# Altium project Miner_8TH.PrjPcb (part 1 of 2)
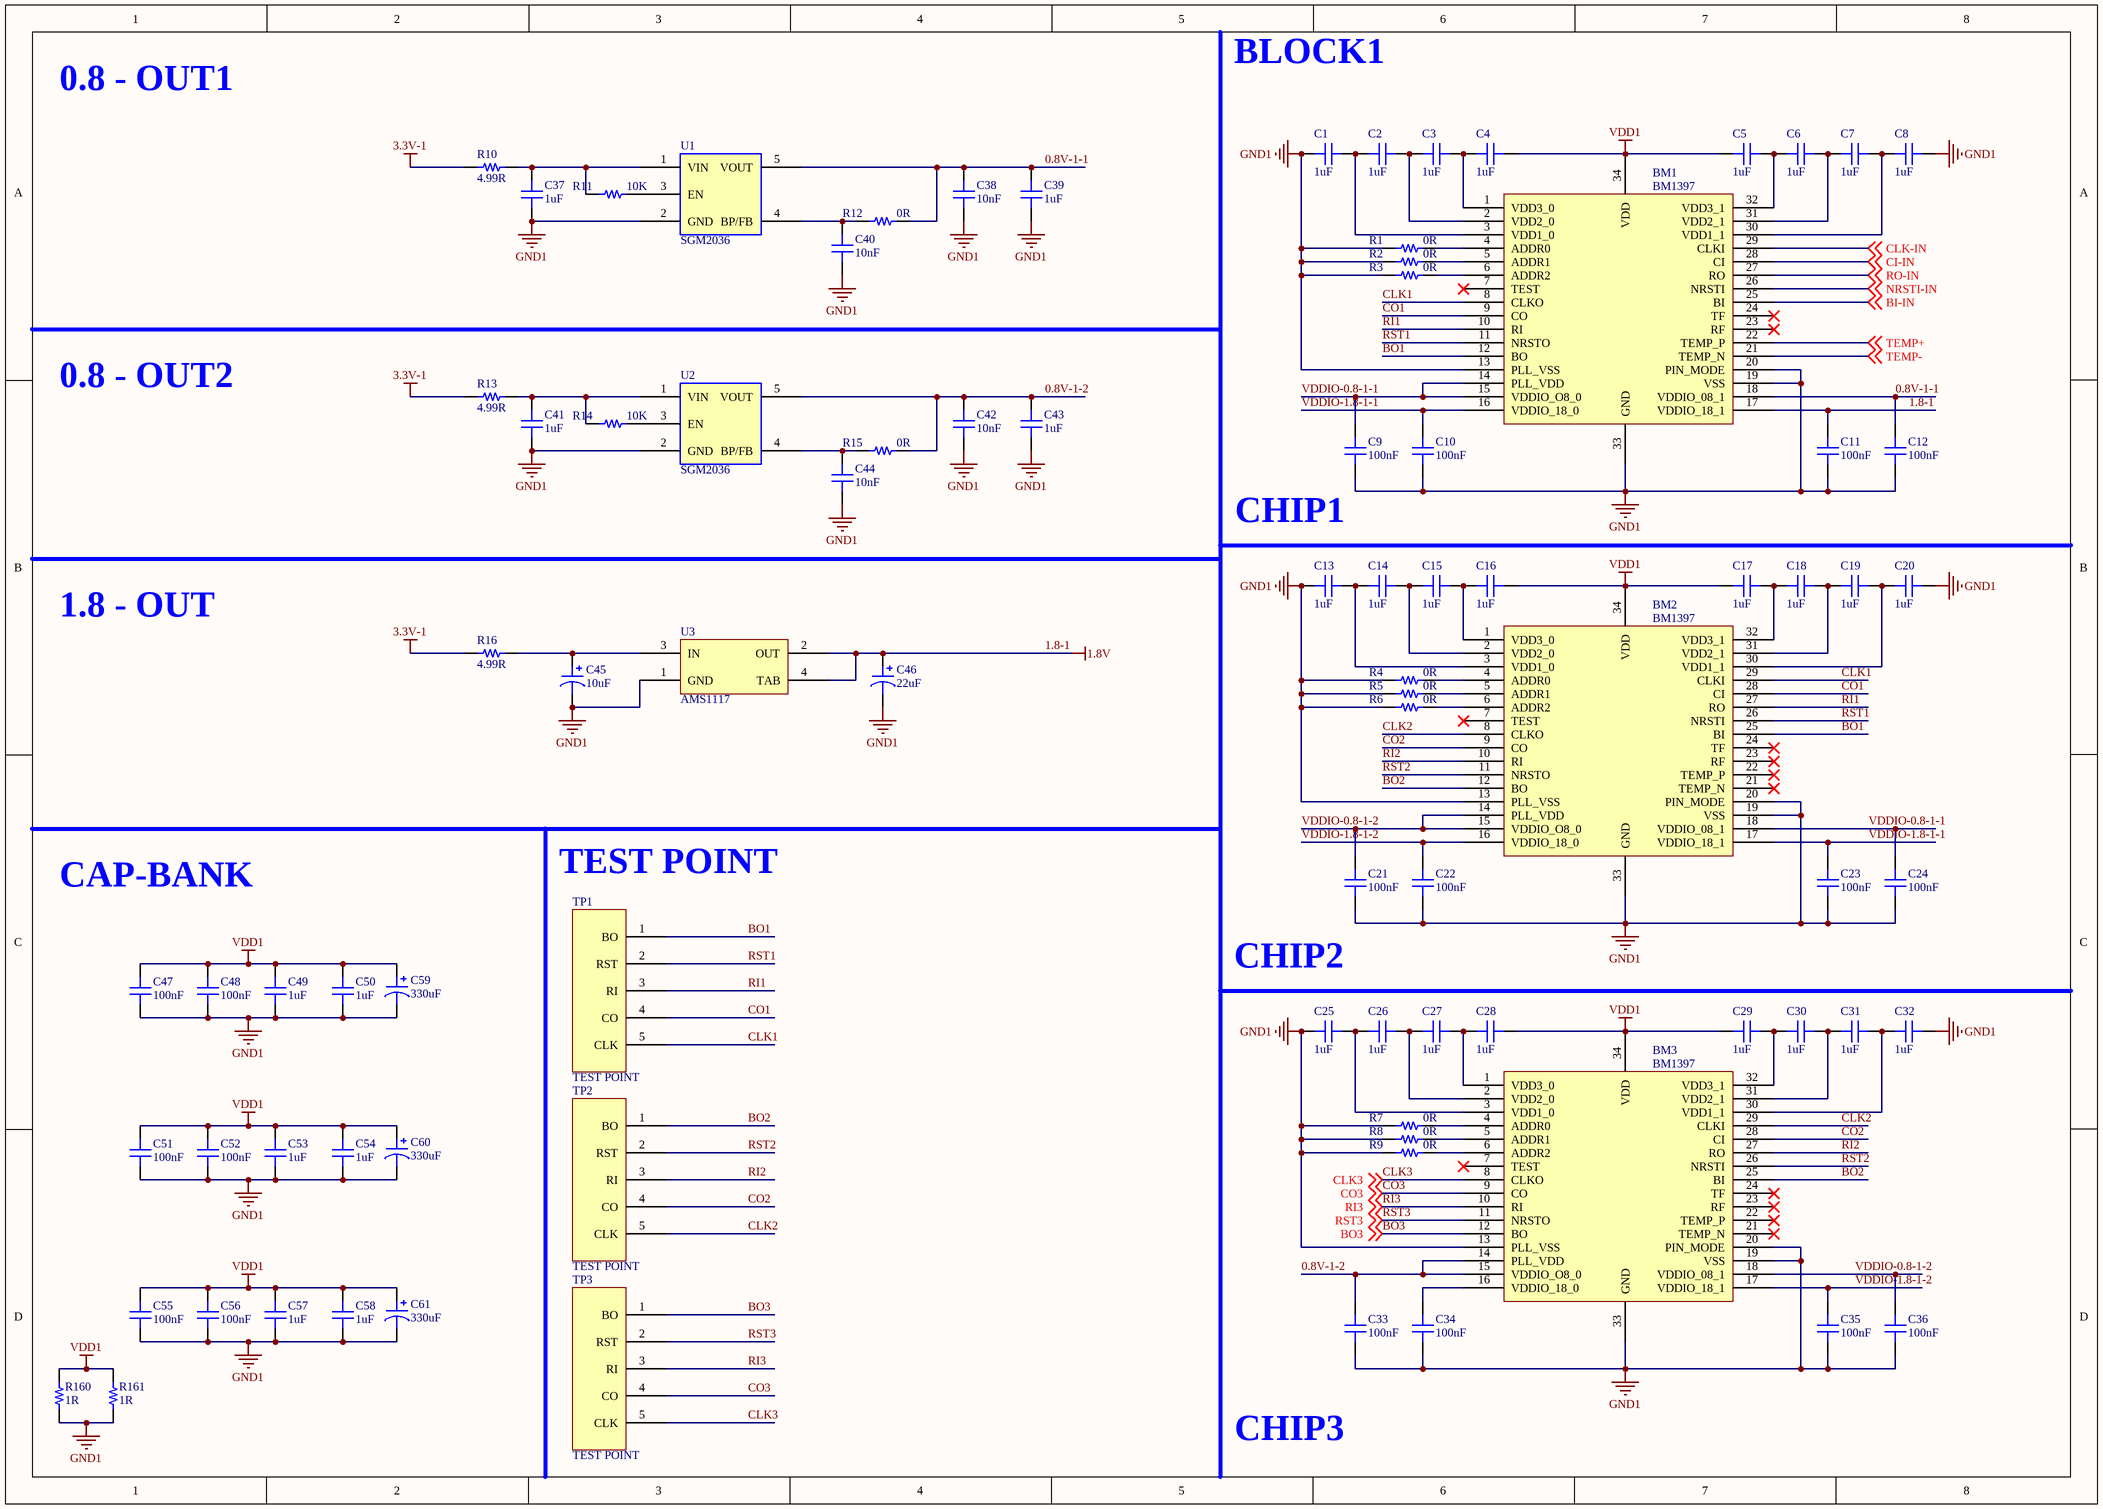
[diagram p0: BLOCK1.SchDoc]
12 sheets, 832 parts. Net scope: global (net labels, ports and power ports of the same name join across sheets).
Board file: Miner_8TH.PcbDoc
Sheets:
  BLOCK1.SchDoc
  BLOCK2.SchDoc
  BLOCK3.SchDoc
  BLOCK4.SchDoc
  BLOCK5.SchDoc
  BLOCK6.SchDoc
  BLOCK7.SchDoc
  BLOCK8.SchDoc
  Prepheral.SchDoc
  Power.SchDoc
  OUTPUT.SchDoc
  HEAT_SINK.SchDoc

## Sheet BLOCK1.SchDoc
size A3; SheetNumber: 1; SheetTotal: 12

### Parts
BM1  BM1397  [BM1387]
BM2  BM1397  [BM1387]
BM3  BM1397  [BM1387]
C1  1uF  [CAP-SMD-0603]
C2  1uF  [CAP-SMD-0603]
C3  1uF  [CAP-SMD-0603]
C4  1uF  [CAP-SMD-0603]
C5  1uF  [CAP-SMD-0603]
C6  1uF  [CAP-SMD-0603]
C7  1uF  [CAP-SMD-0603]
C8  1uF  [CAP-SMD-0603]
C9  100nF  [CAP_SMD_0805]
C10  100nF  [CAP_SMD_0805]
C11  100nF  [CAP_SMD_0805]
C12  100nF  [CAP_SMD_0805]
C13  1uF  [CAP-SMD-0603]
C14  1uF  [CAP-SMD-0603]
C15  1uF  [CAP-SMD-0603]
C16  1uF  [CAP-SMD-0603]
C17  1uF  [CAP-SMD-0603]
C18  1uF  [CAP-SMD-0603]
C19  1uF  [CAP-SMD-0603]
C20  1uF  [CAP-SMD-0603]
C21  100nF  [CAP_SMD_0805]
C22  100nF  [CAP_SMD_0805]
C23  100nF  [CAP_SMD_0805]
C24  100nF  [CAP_SMD_0805]
C25  1uF  [CAP-SMD-0603]
C26  1uF  [CAP-SMD-0603]
C27  1uF  [CAP-SMD-0603]
C28  1uF  [CAP-SMD-0603]
C29  1uF  [CAP-SMD-0603]
C30  1uF  [CAP-SMD-0603]
C31  1uF  [CAP-SMD-0603]
C32  1uF  [CAP-SMD-0603]
C33  100nF  [CAP_SMD_0805]
C34  100nF  [CAP_SMD_0805]
C35  100nF  [CAP_SMD_0805]
C36  100nF  [CAP_SMD_0805]
C37  1uF  [CAP_SMD_0805]
C38  10nF  [CAP_SMD_0805]
C39  1uF  [CAP_SMD_0805]
C40  10nF  [CAP_SMD_0805]
C41  1uF  [CAP_SMD_0805]
C42  10nF  [CAP_SMD_0805]
C43  1uF  [CAP_SMD_0805]
C44  10nF  [CAP_SMD_0805]
C45  10uF  [CAP-TAN-CASE-A]
C46  22uF  [CAP-TAN-CASE-A]
C47  100nF  [CAP_SMD_0805]
C48  100nF  [CAP_SMD_0805]
C49  1uF  [CAP_SMD_0805]
C50  1uF  [CAP_SMD_0805]
C51  100nF  [CAP_SMD_0805]
C52  100nF  [CAP_SMD_0805]
C53  1uF  [CAP_SMD_0805]
C54  1uF  [CAP_SMD_0805]
C55  100nF  [CAP_SMD_0805]
C56  100nF  [CAP_SMD_0805]
C57  1uF  [CAP_SMD_0805]
C58  1uF  [CAP_SMD_0805]
C59  330uF  [CAP-TAN-CASE-E]
C60  330uF  [CAP-TAN-CASE-E]
C61  330uF  [CAP-TAN-CASE-E]
R1  0R  [RES-SMD-0402]
R2  0R  [RES-SMD-0402]
R3  0R  [RES-SMD-0402]
R4  0R  [RES-SMD-0402]
R5  0R  [RES-SMD-0402]
R6  0R  [RES-SMD-0402]
R7  0R  [RES-SMD-0402]
R8  0R  [RES-SMD-0402]
R9  0R  [RES-SMD-0402]
R10  4.99R  [RES-SMD-1206]
R11  10K  [RES-SMD-0402]
R12  0R  [RES-SMD-0402]
R13  4.99R  [RES-SMD-1206]
R14  10K  [RES-SMD-0402]
R15  0R  [RES-SMD-0402]
R16  4.99R  [RES-SMD-1206]
R160  1R  [RES-SMD-1210]
R161  1R  [RES-SMD-1210]
TP1  TEST POINT  [TEST_POINT]
TP2  TEST POINT  [TEST_POINT]
TP3  TEST POINT  [TEST_POINT]
U1  SGM2036  [SOT23-5PIN]
U2  SGM2036  [SOT23-5PIN]
U3  AMS1117  [AMS1117]

### Nets
1.8-1: BM1.17(VDDIO_18_1) C11.2 C46.1 U3.2(OUT) U3.4(TAB)  [also labelled 1.8V]
3.3V-1: R10.1 R13.1 R16.1
GND1: BM1.13(PLL_VSS) BM1.19(VSS) BM1.20(PIN_MODE) BM1.33(GND) BM2.13(PLL_VSS) BM2.19(VSS) BM2.20(PIN_MODE) BM2.33(GND) BM3.13(PLL_VSS) BM3.19(VSS) BM3.20(PIN_MODE) BM3.33(GND) C1.1 C8.2 C9.1 C10.1 C11.1 C12.1 C13.1 C20.2 C21.1 C22.1 C23.1 C24.1 C25.1 C32.2 C33.1 C34.1 C35.1 C36.1 C37.1 C38.1 C39.1 C40.1 C41.1 C42.1 C43.1 C44.1 C45.2 C46.2 C47.1 C48.1 C49.1 C50.1 C51.1 C52.1 C53.1 C54.1 C55.1 C56.1 C57.1 C58.1 C59.2 C60.2 C61.2 R1.1 R2.1 R3.1 R4.1 R5.1 R6.1 R7.1 R8.1 R9.1 R160.1 R161.1 U1.2(GND) U2.2(GND) U3.1(GND)  [project net GND]
VDD1: BM1.34(VDD) BM2.34(VDD) BM3.34(VDD) C4.2 C5.1 C16.2 C17.1 C28.2 C29.1 C47.2 C48.2 C49.2 C50.2 C51.2 C52.2 C53.2 C54.2 C55.2 C56.2 C57.2 C58.2 C59.1 C60.1 C61.1 R160.2 R161.2  [project net GND2]
0.8V-1-1: BM1.18(VDDIO_08_1) C12.2 C38.2 C39.2 R12.2 U1.5(VOUT)
0.8V-1-2: BM3.14(PLL_VDD) BM3.15(VDDIO_O8_0) C33.2 C42.2 C43.2 R15.2 U2.5(VOUT)
BI-IN: BM1.25(BI) ; off-sheet BI-IN
BO1: BM1.12(BO) BM2.25(BI) TP1.1(BO)
BO2: BM2.12(BO) BM3.25(BI) TP2.1(BO)
BO3: BM3.12(BO) TP3.1(BO) ; off-sheet BO3
CI-IN: BM1.28(CI) ; off-sheet CI-IN
CLK1: BM1.8(CLKO) BM2.29(CLKI) TP1.5(CLK)
CLK2: BM2.8(CLKO) BM3.29(CLKI) TP2.5(CLK)
CLK3: BM3.8(CLKO) TP3.5(CLK) ; off-sheet CLK3
CLK-IN: BM1.29(CLKI) ; off-sheet CLK-IN
CO1: BM1.9(CO) BM2.28(CI) TP1.4(CO)
CO2: BM2.9(CO) BM3.28(CI) TP2.4(CO)
CO3: BM3.9(CO) TP3.4(CO) ; off-sheet CO3
NRSTI-IN: BM1.26(NRSTI) ; off-sheet NRSTI-IN
RI1: BM1.10(RI) BM2.27(RO) TP1.3(RI)
RI2: BM2.10(RI) BM3.27(RO) TP2.3(RI)
RI3: BM3.10(RI) TP3.3(RI) ; off-sheet RI3
RO-IN: BM1.27(RO) ; off-sheet RO-IN
RST1: BM1.11(NRSTO) BM2.26(NRSTI) TP1.2(RST)
RST2: BM2.11(NRSTO) BM3.26(NRSTI) TP2.2(RST)
RST3: BM3.11(NRSTO) TP3.2(RST) ; off-sheet RST3
TEMP+: BM1.22(TEMP_P) ; off-sheet TEMP+
TEMP-: BM1.21(TEMP_N) ; off-sheet TEMP-
VDDIO-0.8-1-1: BM1.14(PLL_VDD) BM1.15(VDDIO_O8_0) BM2.18(VDDIO_08_1) C9.2 C24.2
VDDIO-0.8-1-2: BM2.14(PLL_VDD) BM2.15(VDDIO_O8_0) BM3.18(VDDIO_08_1) C21.2 C36.2
VDDIO-1.8-1-1: BM1.16(VDDIO_18_0) BM2.17(VDDIO_18_1) C10.2 C23.2
VDDIO-1.8-1-2: BM2.16(VDDIO_18_0) BM3.17(VDDIO_18_1) C22.2 C35.2
NetBM1_1: BM1.1(VDD3_0) C3.2 C4.1
NetBM1_2: BM1.2(VDD2_0) C2.2 C3.1
NetBM1_3: BM1.3(VDD1_0) C1.2 C2.1
NetBM1_4: BM1.4(ADDR0) R1.2
NetBM1_5: BM1.5(ADDR1) R2.2
NetBM1_6: BM1.6(ADDR2) R3.2
NetBM1_30: BM1.30(VDD1_1) C7.2 C8.1
NetBM1_31: BM1.31(VDD2_1) C6.2 C7.1
NetBM1_32: BM1.32(VDD3_1) C5.2 C6.1
NetBM2_1: BM2.1(VDD3_0) C15.2 C16.1
NetBM2_2: BM2.2(VDD2_0) C14.2 C15.1
NetBM2_3: BM2.3(VDD1_0) C13.2 C14.1
NetBM2_4: BM2.4(ADDR0) R4.2
NetBM2_5: BM2.5(ADDR1) R5.2
NetBM2_6: BM2.6(ADDR2) R6.2
NetBM2_30: BM2.30(VDD1_1) C19.2 C20.1
NetBM2_31: BM2.31(VDD2_1) C18.2 C19.1
NetBM2_32: BM2.32(VDD3_1) C17.2 C18.1
NetBM3_1: BM3.1(VDD3_0) C27.2 C28.1
NetBM3_2: BM3.2(VDD2_0) C26.2 C27.1
NetBM3_3: BM3.3(VDD1_0) C25.2 C26.1
NetBM3_4: BM3.4(ADDR0) R7.2
NetBM3_5: BM3.5(ADDR1) R8.2
NetBM3_6: BM3.6(ADDR2) R9.2
NetBM3_16: BM3.16(VDDIO_18_0) C34.2
NetBM3_30: BM3.30(VDD1_1) C31.2 C32.1
NetBM3_31: BM3.31(VDD2_1) C30.2 C31.1
NetBM3_32: BM3.32(VDD3_1) C29.2 C30.1
NetC37_2: C37.2 R10.2 R11.1 U1.1(VIN)
NetC40_2: C40.2 R12.1 U1.4(BP/FB)
NetC41_2: C41.2 R13.2 R14.1 U2.1(VIN)
NetC44_2: C44.2 R15.1 U2.4(BP/FB)
NetC45_1: C45.1 R16.2 U3.3(IN)
NetR11_2: R11.2 U1.3(EN)
NetR14_2: R14.2 U2.3(EN)

Not connected (* = marked no-connect by the designer): BM1 7(TEST)* 23(RF)* 24(TF)*; BM2 7(TEST)* 21(TEMP_N)* 22(TEMP_P)* 23(RF)* 24(TF)*; BM3 7(TEST)* 21(TEMP_N)* 22(TEMP_P)* 23(RF)* 24(TF)*

### Notes on the sheet
- 0.8 - OUT1
- BLOCK1
- 0.8 - OUT2
- CHIP1
- 1.8 - OUT
- CAP-BANK
- TEST POINT
- CHIP2
- CHIP3

### Library data of the parts
BM1-BM3 = BM1397_0
C1-C44 C47-C58 = CAP
C45 C46 C59-C61 = POLARIZED CAP
R1-R16 R160 R161 = RES

## Sheet BLOCK2.SchDoc
size A3; SheetNumber: 2; SheetTotal: 12
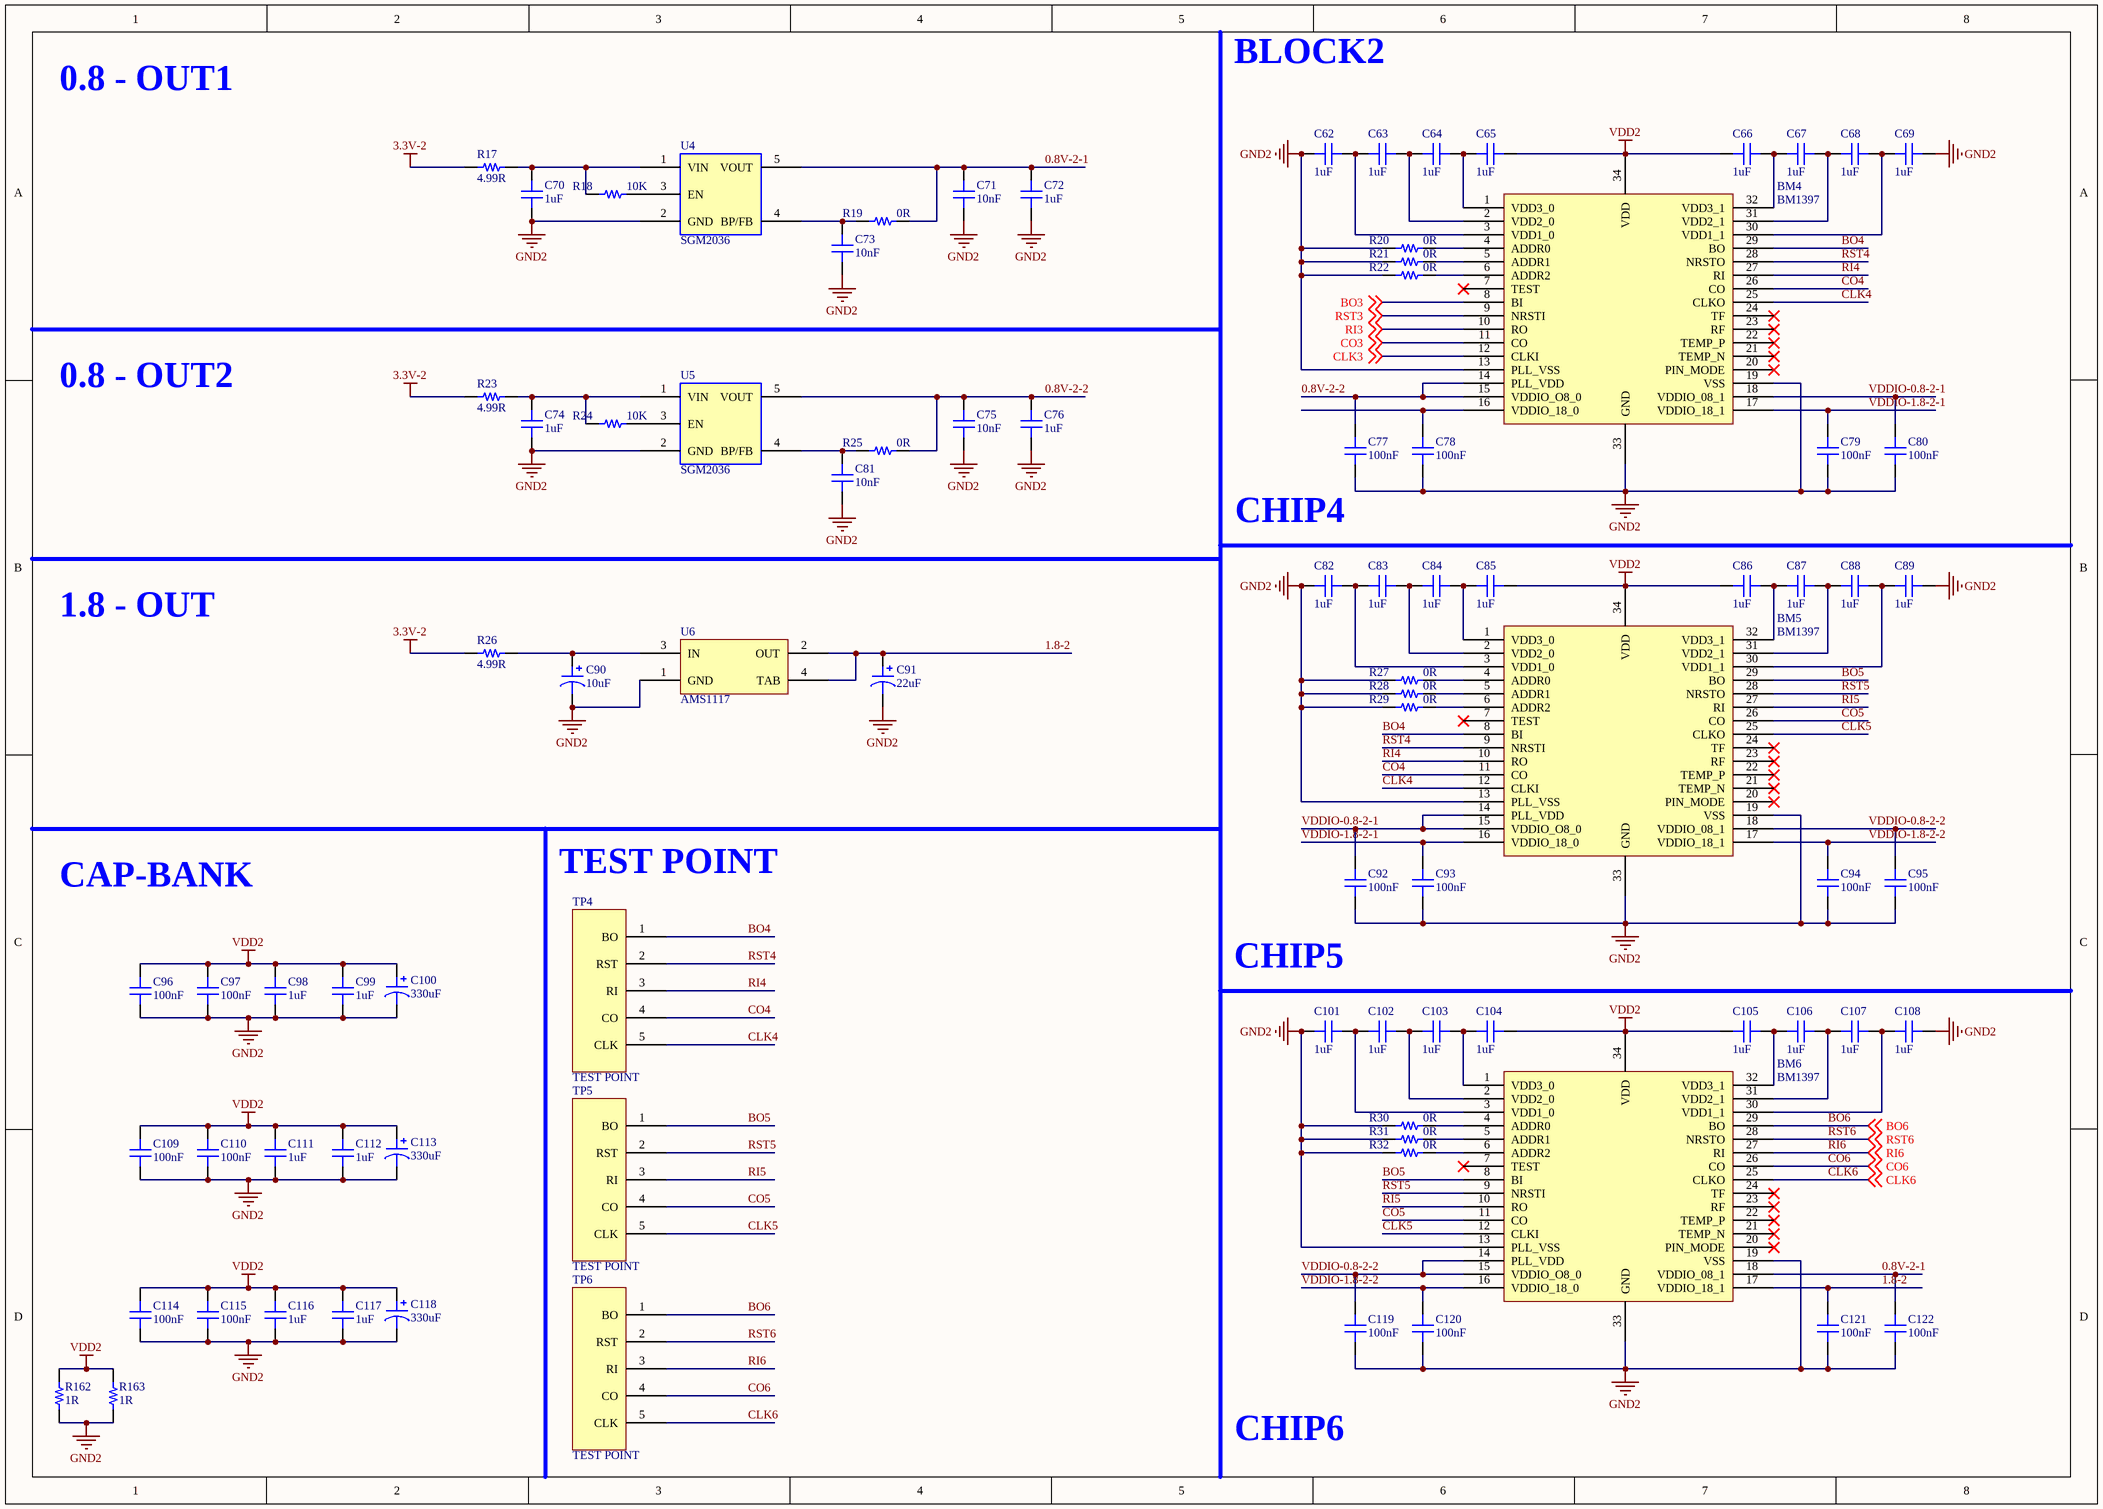
[diagram p1: BLOCK2.SchDoc]

### Parts
BM4  BM1397  [BM1387]
BM5  BM1397  [BM1387]
BM6  BM1397  [BM1387]
C62  1uF  [CAP-SMD-0603]
C63  1uF  [CAP-SMD-0603]
C64  1uF  [CAP-SMD-0603]
C65  1uF  [CAP-SMD-0603]
C66  1uF  [CAP-SMD-0603]
C67  1uF  [CAP-SMD-0603]
C68  1uF  [CAP-SMD-0603]
C69  1uF  [CAP-SMD-0603]
C70  1uF  [CAP_SMD_0805]
C71  10nF  [CAP_SMD_0805]
C72  1uF  [CAP_SMD_0805]
C73  10nF  [CAP_SMD_0805]
C74  1uF  [CAP_SMD_0805]
C75  10nF  [CAP_SMD_0805]
C76  1uF  [CAP_SMD_0805]
C77  100nF  [CAP_SMD_0805]
C78  100nF  [CAP_SMD_0805]
C79  100nF  [CAP_SMD_0805]
C80  100nF  [CAP_SMD_0805]
C81  10nF  [CAP_SMD_0805]
C82  1uF  [CAP-SMD-0603]
C83  1uF  [CAP-SMD-0603]
C84  1uF  [CAP-SMD-0603]
C85  1uF  [CAP-SMD-0603]
C86  1uF  [CAP-SMD-0603]
C87  1uF  [CAP-SMD-0603]
C88  1uF  [CAP-SMD-0603]
C89  1uF  [CAP-SMD-0603]
C90  10uF  [CAP-TAN-CASE-A]
C91  22uF  [CAP-TAN-CASE-A]
C92  100nF  [CAP_SMD_0805]
C93  100nF  [CAP_SMD_0805]
C94  100nF  [CAP_SMD_0805]
C95  100nF  [CAP_SMD_0805]
C96  100nF  [CAP_SMD_0805]
C97  100nF  [CAP_SMD_0805]
C98  1uF  [CAP_SMD_0805]
C99  1uF  [CAP_SMD_0805]
C100  330uF  [CAP-TAN-CASE-E]
C101  1uF  [CAP-SMD-0603]
C102  1uF  [CAP-SMD-0603]
C103  1uF  [CAP-SMD-0603]
C104  1uF  [CAP-SMD-0603]
C105  1uF  [CAP-SMD-0603]
C106  1uF  [CAP-SMD-0603]
C107  1uF  [CAP-SMD-0603]
C108  1uF  [CAP-SMD-0603]
C109  100nF  [CAP_SMD_0805]
C110  100nF  [CAP_SMD_0805]
C111  1uF  [CAP_SMD_0805]
C112  1uF  [CAP_SMD_0805]
C113  330uF  [CAP-TAN-CASE-E]
C114  100nF  [CAP_SMD_0805]
C115  100nF  [CAP_SMD_0805]
C116  1uF  [CAP_SMD_0805]
C117  1uF  [CAP_SMD_0805]
C118  330uF  [CAP-TAN-CASE-E]
C119  100nF  [CAP_SMD_0805]
C120  100nF  [CAP_SMD_0805]
C121  100nF  [CAP_SMD_0805]
C122  100nF  [CAP_SMD_0805]
R17  4.99R  [RES-SMD-1206]
R18  10K  [RES-SMD-0402]
R19  0R  [RES-SMD-0402]
R20  0R  [RES-SMD-0402]
R21  0R  [RES-SMD-0402]
R22  0R  [RES-SMD-0402]
R23  4.99R  [RES-SMD-1206]
R24  10K  [RES-SMD-0402]
R25  0R  [RES-SMD-0402]
R26  4.99R  [RES-SMD-1206]
R27  0R  [RES-SMD-0402]
R28  0R  [RES-SMD-0402]
R29  0R  [RES-SMD-0402]
R30  0R  [RES-SMD-0402]
R31  0R  [RES-SMD-0402]
R32  0R  [RES-SMD-0402]
R162  1R  [RES-SMD-1210]
R163  1R  [RES-SMD-1210]
TP4  TEST POINT  [TEST_POINT]
TP5  TEST POINT  [TEST_POINT]
TP6  TEST POINT  [TEST_POINT]
U4  SGM2036  [SOT23-5PIN]
U5  SGM2036  [SOT23-5PIN]
U6  AMS1117  [AMS1117]

### Nets
3.3V-2: R17.1 R23.1 R26.1
GND2: BM4.13(PLL_VSS) BM4.19(VSS) BM4.33(GND) BM5.13(PLL_VSS) BM5.19(VSS) BM5.33(GND) BM6.13(PLL_VSS) BM6.19(VSS) BM6.33(GND) C62.1 C69.2 C70.1 C71.1 C72.1 C73.1 C74.1 C75.1 C76.1 C77.1 C78.1 C79.1 C80.1 C81.1 C82.1 C89.2 C90.2 C91.2 C92.1 C93.1 C94.1 C95.1 C96.1 C97.1 C98.1 C99.1 C100.2 C101.1 C108.2 C109.1 C110.1 C111.1 C112.1 C113.2 C114.1 C115.1 C116.1 C117.1 C118.2 C119.1 C120.1 C121.1 C122.1 R20.1 R21.1 R22.1 R27.1 R28.1 R29.1 R30.1 R31.1 R32.1 R162.1 R163.1 U4.2(GND) U5.2(GND) U6.1(GND)
VDD2: BM4.34(VDD) BM5.34(VDD) BM6.34(VDD) C65.2 C66.1 C85.2 C86.1 C96.2 C97.2 C98.2 C99.2 C100.1 C104.2 C105.1 C109.2 C110.2 C111.2 C112.2 C113.1 C114.2 C115.2 C116.2 C117.2 C118.1 R162.2 R163.2  [project net 3.3V-1]
0.8V-2-1: BM6.18(VDDIO_08_1) C71.2 C72.2 C122.2 R19.2 U4.5(VOUT)
0.8V-2-2: BM4.14(PLL_VDD) BM4.15(VDDIO_O8_0) C75.2 C76.2 C77.2 R25.2 U5.5(VOUT)
1.8-2: BM6.17(VDDIO_18_1) C91.1 C121.2 U6.2(OUT) U6.4(TAB)
BO3: BM4.8(BI) ; off-sheet BO3
BO4: BM4.29(BO) BM5.8(BI) TP4.1(BO)
BO5: BM5.29(BO) BM6.8(BI) TP5.1(BO)
BO6: BM6.29(BO) TP6.1(BO) ; off-sheet BO6
CLK3: BM4.12(CLKI) ; off-sheet CLK3
CLK4: BM4.25(CLKO) BM5.12(CLKI) TP4.5(CLK)
CLK5: BM5.25(CLKO) BM6.12(CLKI) TP5.5(CLK)
CLK6: BM6.25(CLKO) TP6.5(CLK) ; off-sheet CLK6
CO3: BM4.11(CO) ; off-sheet CO3
CO4: BM4.26(CO) BM5.11(CO) TP4.4(CO)
CO5: BM5.26(CO) BM6.11(CO) TP5.4(CO)
CO6: BM6.26(CO) TP6.4(CO) ; off-sheet CO6
RI3: BM4.10(RO) ; off-sheet RI3
RI4: BM4.27(RI) BM5.10(RO) TP4.3(RI)
RI5: BM5.27(RI) BM6.10(RO) TP5.3(RI)
RI6: BM6.27(RI) TP6.3(RI) ; off-sheet RI6
RST3: BM4.9(NRSTI) ; off-sheet RST3
RST4: BM4.28(NRSTO) BM5.9(NRSTI) TP4.2(RST)
RST5: BM5.28(NRSTO) BM6.9(NRSTI) TP5.2(RST)
RST6: BM6.28(NRSTO) TP6.2(RST) ; off-sheet RST6
VDDIO-0.8-2-1: BM4.18(VDDIO_08_1) BM5.14(PLL_VDD) BM5.15(VDDIO_O8_0) C80.2 C92.2
VDDIO-0.8-2-2: BM5.18(VDDIO_08_1) BM6.14(PLL_VDD) BM6.15(VDDIO_O8_0) C95.2 C119.2
VDDIO-1.8-2-1: BM4.17(VDDIO_18_1) BM5.16(VDDIO_18_0) C79.2 C93.2
VDDIO-1.8-2-2: BM5.17(VDDIO_18_1) BM6.16(VDDIO_18_0) C94.2 C120.2
NetBM4_1: BM4.1(VDD3_0) C64.2 C65.1
NetBM4_2: BM4.2(VDD2_0) C63.2 C64.1
NetBM4_3: BM4.3(VDD1_0) C62.2 C63.1
NetBM4_4: BM4.4(ADDR0) R20.2
NetBM4_5: BM4.5(ADDR1) R21.2
NetBM4_6: BM4.6(ADDR2) R22.2
NetBM4_16: BM4.16(VDDIO_18_0) C78.2
NetBM4_30: BM4.30(VDD1_1) C68.2 C69.1
NetBM4_31: BM4.31(VDD2_1) C67.2 C68.1
NetBM4_32: BM4.32(VDD3_1) C66.2 C67.1
NetBM5_1: BM5.1(VDD3_0) C84.2 C85.1
NetBM5_2: BM5.2(VDD2_0) C83.2 C84.1
NetBM5_3: BM5.3(VDD1_0) C82.2 C83.1
NetBM5_4: BM5.4(ADDR0) R27.2
NetBM5_5: BM5.5(ADDR1) R28.2
NetBM5_6: BM5.6(ADDR2) R29.2
NetBM5_30: BM5.30(VDD1_1) C88.2 C89.1
NetBM5_31: BM5.31(VDD2_1) C87.2 C88.1
NetBM5_32: BM5.32(VDD3_1) C86.2 C87.1
NetBM6_1: BM6.1(VDD3_0) C103.2 C104.1
NetBM6_2: BM6.2(VDD2_0) C102.2 C103.1
NetBM6_3: BM6.3(VDD1_0) C101.2 C102.1
NetBM6_4: BM6.4(ADDR0) R30.2
NetBM6_5: BM6.5(ADDR1) R31.2
NetBM6_6: BM6.6(ADDR2) R32.2
NetBM6_30: BM6.30(VDD1_1) C107.2 C108.1
NetBM6_31: BM6.31(VDD2_1) C106.2 C107.1
NetBM6_32: BM6.32(VDD3_1) C105.2 C106.1
NetC70_2: C70.2 R17.2 R18.1 U4.1(VIN)
NetC73_2: C73.2 R19.1 U4.4(BP/FB)
NetC74_2: C74.2 R23.2 R24.1 U5.1(VIN)
NetC81_2: C81.2 R25.1 U5.4(BP/FB)
NetC90_1: C90.1 R26.2 U6.3(IN)
NetR18_2: R18.2 U4.3(EN)
NetR24_2: R24.2 U5.3(EN)

Not connected (* = marked no-connect by the designer): BM4 7(TEST)* 20(PIN_MODE)* 21(TEMP_N)* 22(TEMP_P)* 23(RF)* 24(TF)*; BM5 7(TEST)* 20(PIN_MODE)* 21(TEMP_N)* 22(TEMP_P)* 23(RF)* 24(TF)*; BM6 7(TEST)* 20(PIN_MODE)* 21(TEMP_N)* 22(TEMP_P)* 23(RF)* 24(TF)*

### Notes on the sheet
- 0.8 - OUT1
- BLOCK2
- 0.8 - OUT2
- CHIP4
- 1.8 - OUT
- CAP-BANK
- TEST POINT
- CHIP5
- CHIP6

### Library data of the parts
BM4-BM6 = BM1397_1
C62-C89 C92-C99 C101-C112 C114-C117 C119-C122 = CAP
C90 C91 C100 C113 C118 = POLARIZED CAP
R17-R32 R162 R163 = RES

## Sheet BLOCK3.SchDoc
size A3; SheetNumber: 3; SheetTotal: 12
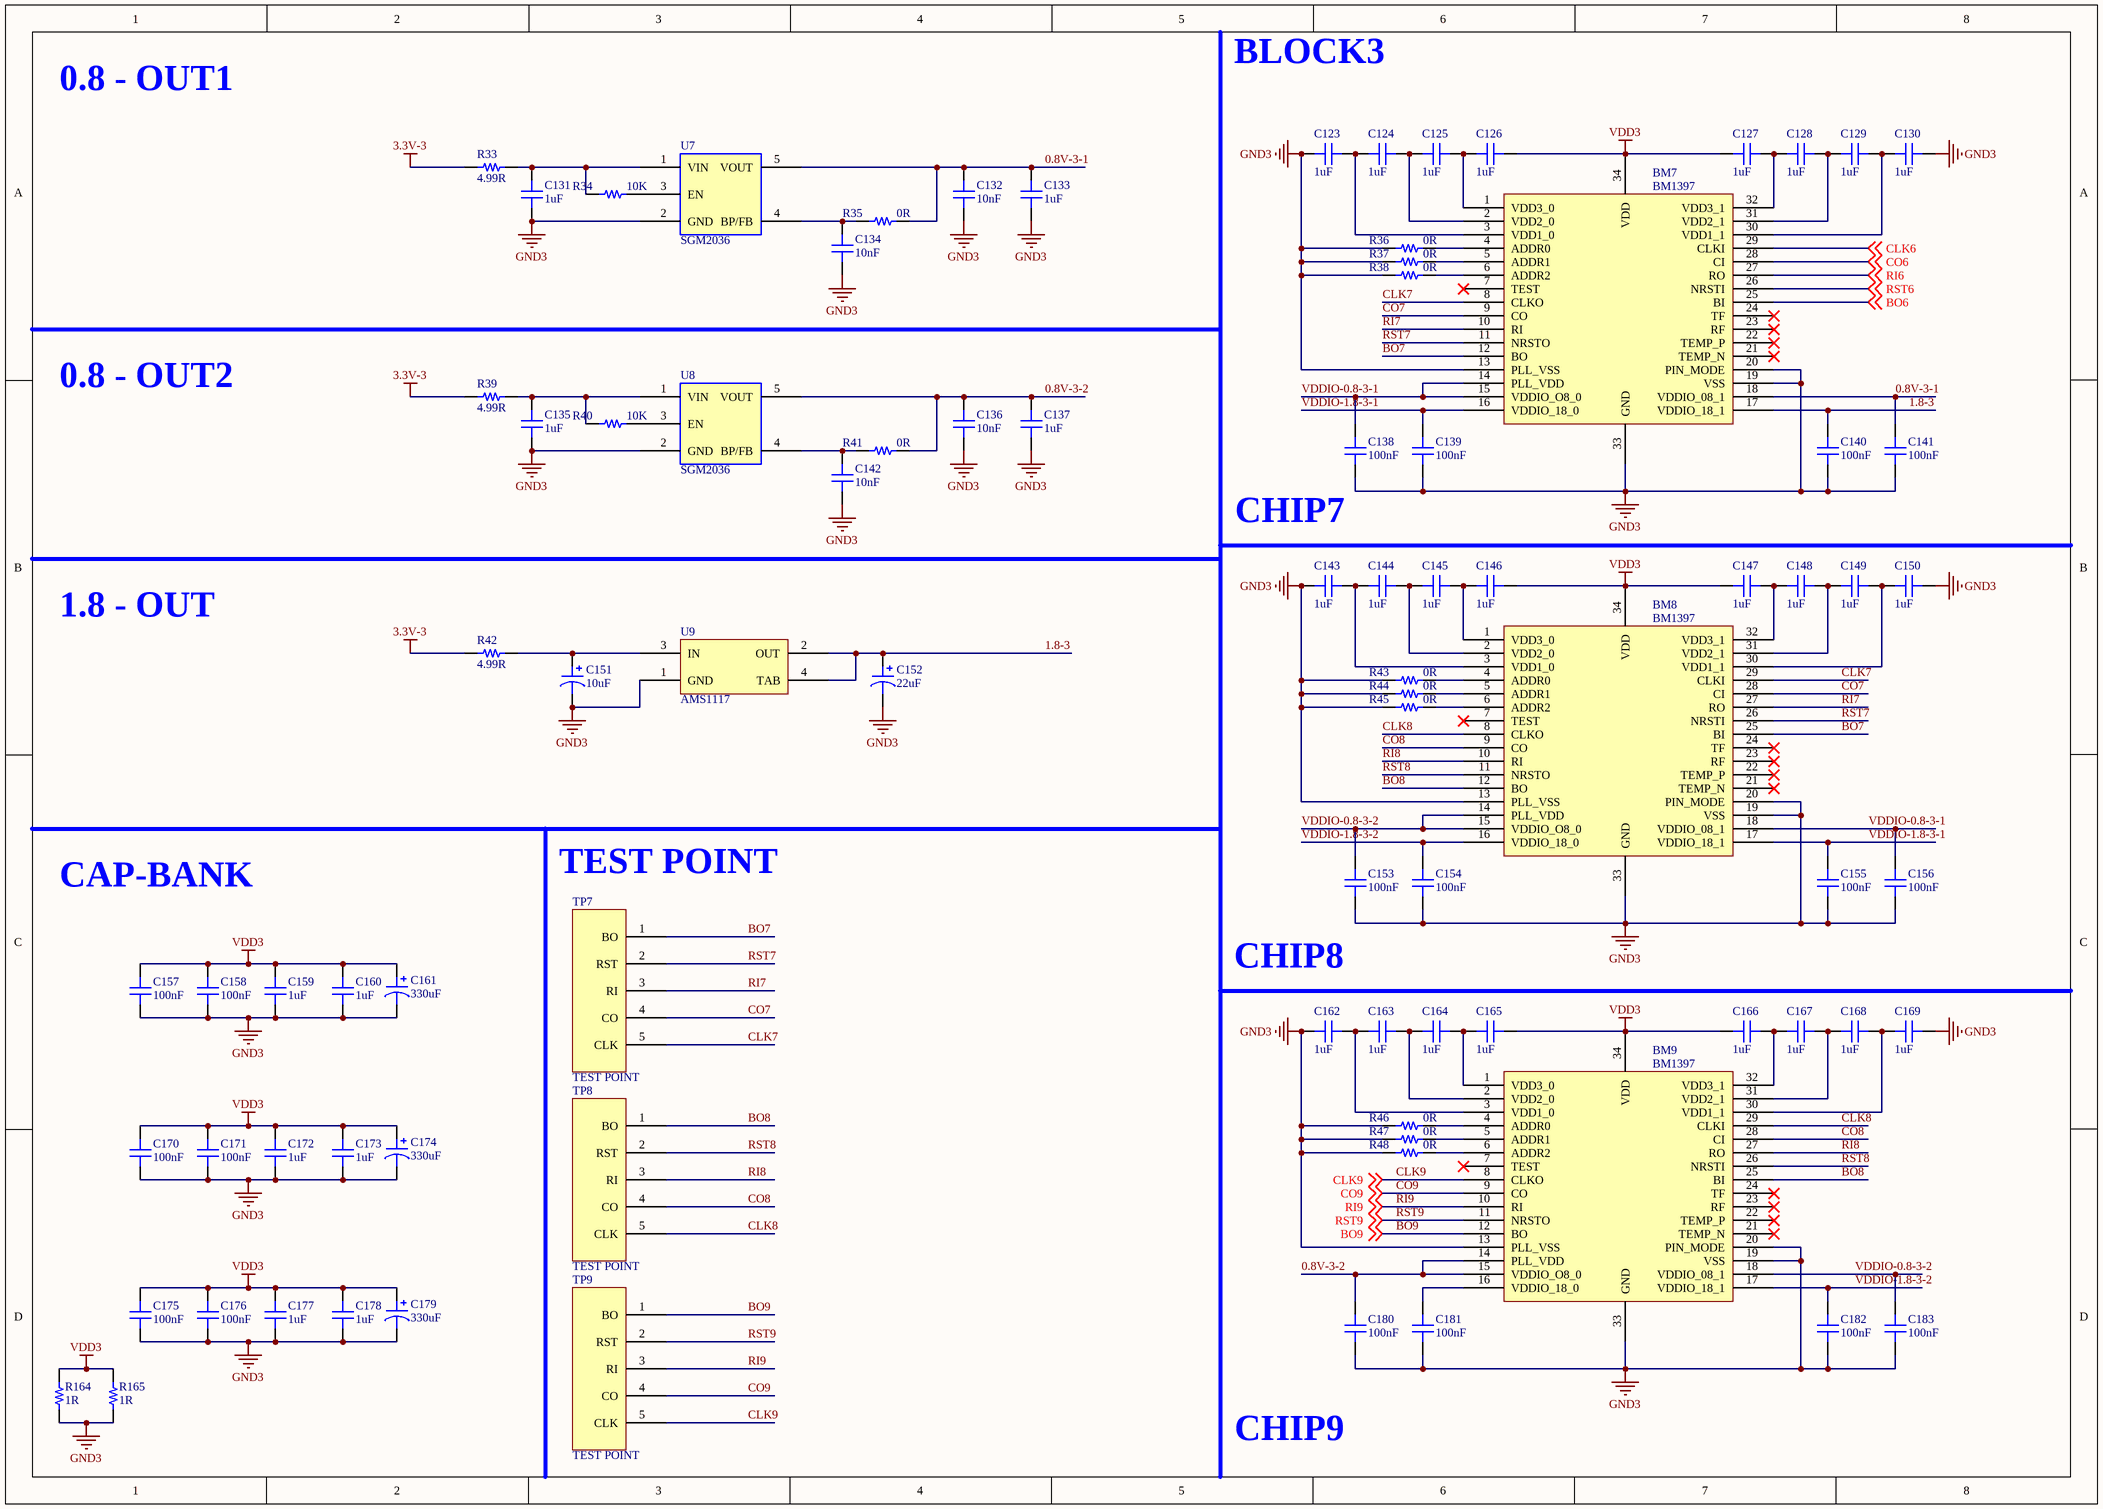
[diagram p2: BLOCK3.SchDoc]

### Parts
BM7  BM1397  [BM1387]
BM8  BM1397  [BM1387]
BM9  BM1397  [BM1387]
C123  1uF  [CAP-SMD-0603]
C124  1uF  [CAP-SMD-0603]
C125  1uF  [CAP-SMD-0603]
C126  1uF  [CAP-SMD-0603]
C127  1uF  [CAP-SMD-0603]
C128  1uF  [CAP-SMD-0603]
C129  1uF  [CAP-SMD-0603]
C130  1uF  [CAP-SMD-0603]
C131  1uF  [CAP_SMD_0805]
C132  10nF  [CAP_SMD_0805]
C133  1uF  [CAP_SMD_0805]
C134  10nF  [CAP_SMD_0805]
C135  1uF  [CAP_SMD_0805]
C136  10nF  [CAP_SMD_0805]
C137  1uF  [CAP_SMD_0805]
C138  100nF  [CAP_SMD_0805]
C139  100nF  [CAP_SMD_0805]
C140  100nF  [CAP_SMD_0805]
C141  100nF  [CAP_SMD_0805]
C142  10nF  [CAP_SMD_0805]
C143  1uF  [CAP-SMD-0603]
C144  1uF  [CAP-SMD-0603]
C145  1uF  [CAP-SMD-0603]
C146  1uF  [CAP-SMD-0603]
C147  1uF  [CAP-SMD-0603]
C148  1uF  [CAP-SMD-0603]
C149  1uF  [CAP-SMD-0603]
C150  1uF  [CAP-SMD-0603]
C151  10uF  [CAP-TAN-CASE-A]
C152  22uF  [CAP-TAN-CASE-A]
C153  100nF  [CAP_SMD_0805]
C154  100nF  [CAP_SMD_0805]
C155  100nF  [CAP_SMD_0805]
C156  100nF  [CAP_SMD_0805]
C157  100nF  [CAP_SMD_0805]
C158  100nF  [CAP_SMD_0805]
C159  1uF  [CAP_SMD_0805]
C160  1uF  [CAP_SMD_0805]
C161  330uF  [CAP-TAN-CASE-E]
C162  1uF  [CAP-SMD-0603]
C163  1uF  [CAP-SMD-0603]
C164  1uF  [CAP-SMD-0603]
C165  1uF  [CAP-SMD-0603]
C166  1uF  [CAP-SMD-0603]
C167  1uF  [CAP-SMD-0603]
C168  1uF  [CAP-SMD-0603]
C169  1uF  [CAP-SMD-0603]
C170  100nF  [CAP_SMD_0805]
C171  100nF  [CAP_SMD_0805]
C172  1uF  [CAP_SMD_0805]
C173  1uF  [CAP_SMD_0805]
C174  330uF  [CAP-TAN-CASE-E]
C175  100nF  [CAP_SMD_0805]
C176  100nF  [CAP_SMD_0805]
C177  1uF  [CAP_SMD_0805]
C178  1uF  [CAP_SMD_0805]
C179  330uF  [CAP-TAN-CASE-E]
C180  100nF  [CAP_SMD_0805]
C181  100nF  [CAP_SMD_0805]
C182  100nF  [CAP_SMD_0805]
C183  100nF  [CAP_SMD_0805]
R33  4.99R  [RES-SMD-1206]
R34  10K  [RES-SMD-0402]
R35  0R  [RES-SMD-0402]
R36  0R  [RES-SMD-0402]
R37  0R  [RES-SMD-0402]
R38  0R  [RES-SMD-0402]
R39  4.99R  [RES-SMD-1206]
R40  10K  [RES-SMD-0402]
R41  0R  [RES-SMD-0402]
R42  4.99R  [RES-SMD-1206]
R43  0R  [RES-SMD-0402]
R44  0R  [RES-SMD-0402]
R45  0R  [RES-SMD-0402]
R46  0R  [RES-SMD-0402]
R47  0R  [RES-SMD-0402]
R48  0R  [RES-SMD-0402]
R164  1R  [RES-SMD-1210]
R165  1R  [RES-SMD-1210]
TP7  TEST POINT  [TEST_POINT]
TP8  TEST POINT  [TEST_POINT]
TP9  TEST POINT  [TEST_POINT]
U7  SGM2036  [SOT23-5PIN]
U8  SGM2036  [SOT23-5PIN]
U9  AMS1117  [AMS1117]

### Nets
3.3V-3: R33.1 R39.1 R42.1
GND3: BM7.13(PLL_VSS) BM7.19(VSS) BM7.20(PIN_MODE) BM7.33(GND) BM8.13(PLL_VSS) BM8.19(VSS) BM8.20(PIN_MODE) BM8.33(GND) BM9.13(PLL_VSS) BM9.19(VSS) BM9.20(PIN_MODE) BM9.33(GND) C123.1 C130.2 C131.1 C132.1 C133.1 C134.1 C135.1 C136.1 C137.1 C138.1 C139.1 C140.1 C141.1 C142.1 C143.1 C150.2 C151.2 C152.2 C153.1 C154.1 C155.1 C156.1 C157.1 C158.1 C159.1 C160.1 C161.2 C162.1 C169.2 C170.1 C171.1 C172.1 C173.1 C174.2 C175.1 C176.1 C177.1 C178.1 C179.2 C180.1 C181.1 C182.1 C183.1 R36.1 R37.1 R38.1 R43.1 R44.1 R45.1 R46.1 R47.1 R48.1 R164.1 R165.1 U7.2(GND) U8.2(GND) U9.1(GND)  [project net 3.3V-1]
VDD3: BM7.34(VDD) BM8.34(VDD) BM9.34(VDD) C126.2 C127.1 C146.2 C147.1 C157.2 C158.2 C159.2 C160.2 C161.1 C165.2 C166.1 C170.2 C171.2 C172.2 C173.2 C174.1 C175.2 C176.2 C177.2 C178.2 C179.1 R164.2 R165.2  [project net 3.3V-2]
0.8V-3-1: BM7.18(VDDIO_08_1) C132.2 C133.2 C141.2 R35.2 U7.5(VOUT)
0.8V-3-2: BM9.14(PLL_VDD) BM9.15(VDDIO_O8_0) C136.2 C137.2 C180.2 R41.2 U8.5(VOUT)
1.8-3: BM7.17(VDDIO_18_1) C140.2 C152.1 U9.2(OUT) U9.4(TAB)
BO6: BM7.25(BI) ; off-sheet BO6
BO7: BM7.12(BO) BM8.25(BI) TP7.1(BO)
BO8: BM8.12(BO) BM9.25(BI) TP8.1(BO)
BO9: BM9.12(BO) TP9.1(BO) ; off-sheet BO9
CLK6: BM7.29(CLKI) ; off-sheet CLK6
CLK7: BM7.8(CLKO) BM8.29(CLKI) TP7.5(CLK)
CLK8: BM8.8(CLKO) BM9.29(CLKI) TP8.5(CLK)
CLK9: BM9.8(CLKO) TP9.5(CLK) ; off-sheet CLK9
CO6: BM7.28(CI) ; off-sheet CO6
CO7: BM7.9(CO) BM8.28(CI) TP7.4(CO)
CO8: BM8.9(CO) BM9.28(CI) TP8.4(CO)
CO9: BM9.9(CO) TP9.4(CO) ; off-sheet CO9
RI6: BM7.27(RO) ; off-sheet RI6
RI7: BM7.10(RI) BM8.27(RO) TP7.3(RI)
RI8: BM8.10(RI) BM9.27(RO) TP8.3(RI)
RI9: BM9.10(RI) TP9.3(RI) ; off-sheet RI9
RST6: BM7.26(NRSTI) ; off-sheet RST6
RST7: BM7.11(NRSTO) BM8.26(NRSTI) TP7.2(RST)
RST8: BM8.11(NRSTO) BM9.26(NRSTI) TP8.2(RST)
RST9: BM9.11(NRSTO) TP9.2(RST) ; off-sheet RST9
VDDIO-0.8-3-1: BM7.14(PLL_VDD) BM7.15(VDDIO_O8_0) BM8.18(VDDIO_08_1) C138.2 C156.2
VDDIO-0.8-3-2: BM8.14(PLL_VDD) BM8.15(VDDIO_O8_0) BM9.18(VDDIO_08_1) C153.2 C183.2
VDDIO-1.8-3-1: BM7.16(VDDIO_18_0) BM8.17(VDDIO_18_1) C139.2 C155.2
VDDIO-1.8-3-2: BM8.16(VDDIO_18_0) BM9.17(VDDIO_18_1) C154.2 C182.2
NetBM7_1: BM7.1(VDD3_0) C125.2 C126.1
NetBM7_2: BM7.2(VDD2_0) C124.2 C125.1
NetBM7_3: BM7.3(VDD1_0) C123.2 C124.1
NetBM7_4: BM7.4(ADDR0) R36.2
NetBM7_5: BM7.5(ADDR1) R37.2
NetBM7_6: BM7.6(ADDR2) R38.2
NetBM7_30: BM7.30(VDD1_1) C129.2 C130.1
NetBM7_31: BM7.31(VDD2_1) C128.2 C129.1
NetBM7_32: BM7.32(VDD3_1) C127.2 C128.1
NetBM8_1: BM8.1(VDD3_0) C145.2 C146.1
NetBM8_2: BM8.2(VDD2_0) C144.2 C145.1
NetBM8_3: BM8.3(VDD1_0) C143.2 C144.1
NetBM8_4: BM8.4(ADDR0) R43.2
NetBM8_5: BM8.5(ADDR1) R44.2
NetBM8_6: BM8.6(ADDR2) R45.2
NetBM8_30: BM8.30(VDD1_1) C149.2 C150.1
NetBM8_31: BM8.31(VDD2_1) C148.2 C149.1
NetBM8_32: BM8.32(VDD3_1) C147.2 C148.1
NetBM9_1: BM9.1(VDD3_0) C164.2 C165.1
NetBM9_2: BM9.2(VDD2_0) C163.2 C164.1
NetBM9_3: BM9.3(VDD1_0) C162.2 C163.1
NetBM9_4: BM9.4(ADDR0) R46.2
NetBM9_5: BM9.5(ADDR1) R47.2
NetBM9_6: BM9.6(ADDR2) R48.2
NetBM9_16: BM9.16(VDDIO_18_0) C181.2
NetBM9_30: BM9.30(VDD1_1) C168.2 C169.1
NetBM9_31: BM9.31(VDD2_1) C167.2 C168.1
NetBM9_32: BM9.32(VDD3_1) C166.2 C167.1
NetC131_2: C131.2 R33.2 R34.1 U7.1(VIN)
NetC134_2: C134.2 R35.1 U7.4(BP/FB)
NetC135_2: C135.2 R39.2 R40.1 U8.1(VIN)
NetC142_2: C142.2 R41.1 U8.4(BP/FB)
NetC151_1: C151.1 R42.2 U9.3(IN)
NetR34_2: R34.2 U7.3(EN)
NetR40_2: R40.2 U8.3(EN)

Not connected (* = marked no-connect by the designer): BM7 7(TEST)* 21(TEMP_N)* 22(TEMP_P)* 23(RF)* 24(TF)*; BM8 7(TEST)* 21(TEMP_N)* 22(TEMP_P)* 23(RF)* 24(TF)*; BM9 7(TEST)* 21(TEMP_N)* 22(TEMP_P)* 23(RF)* 24(TF)*

### Notes on the sheet
- 0.8 - OUT1
- BLOCK3
- 0.8 - OUT2
- CHIP7
- 1.8 - OUT
- CAP-BANK
- TEST POINT
- CHIP8
- CHIP9

### Library data of the parts
BM7-BM9 = BM1397_0
C123-C150 C153-C160 C162-C173 C175-C178 C180-C183 = CAP
C151 C152 C161 C174 C179 = POLARIZED CAP
R33-R48 R164 R165 = RES

## Sheet BLOCK4.SchDoc
size A3; SheetNumber: 4; SheetTotal: 12
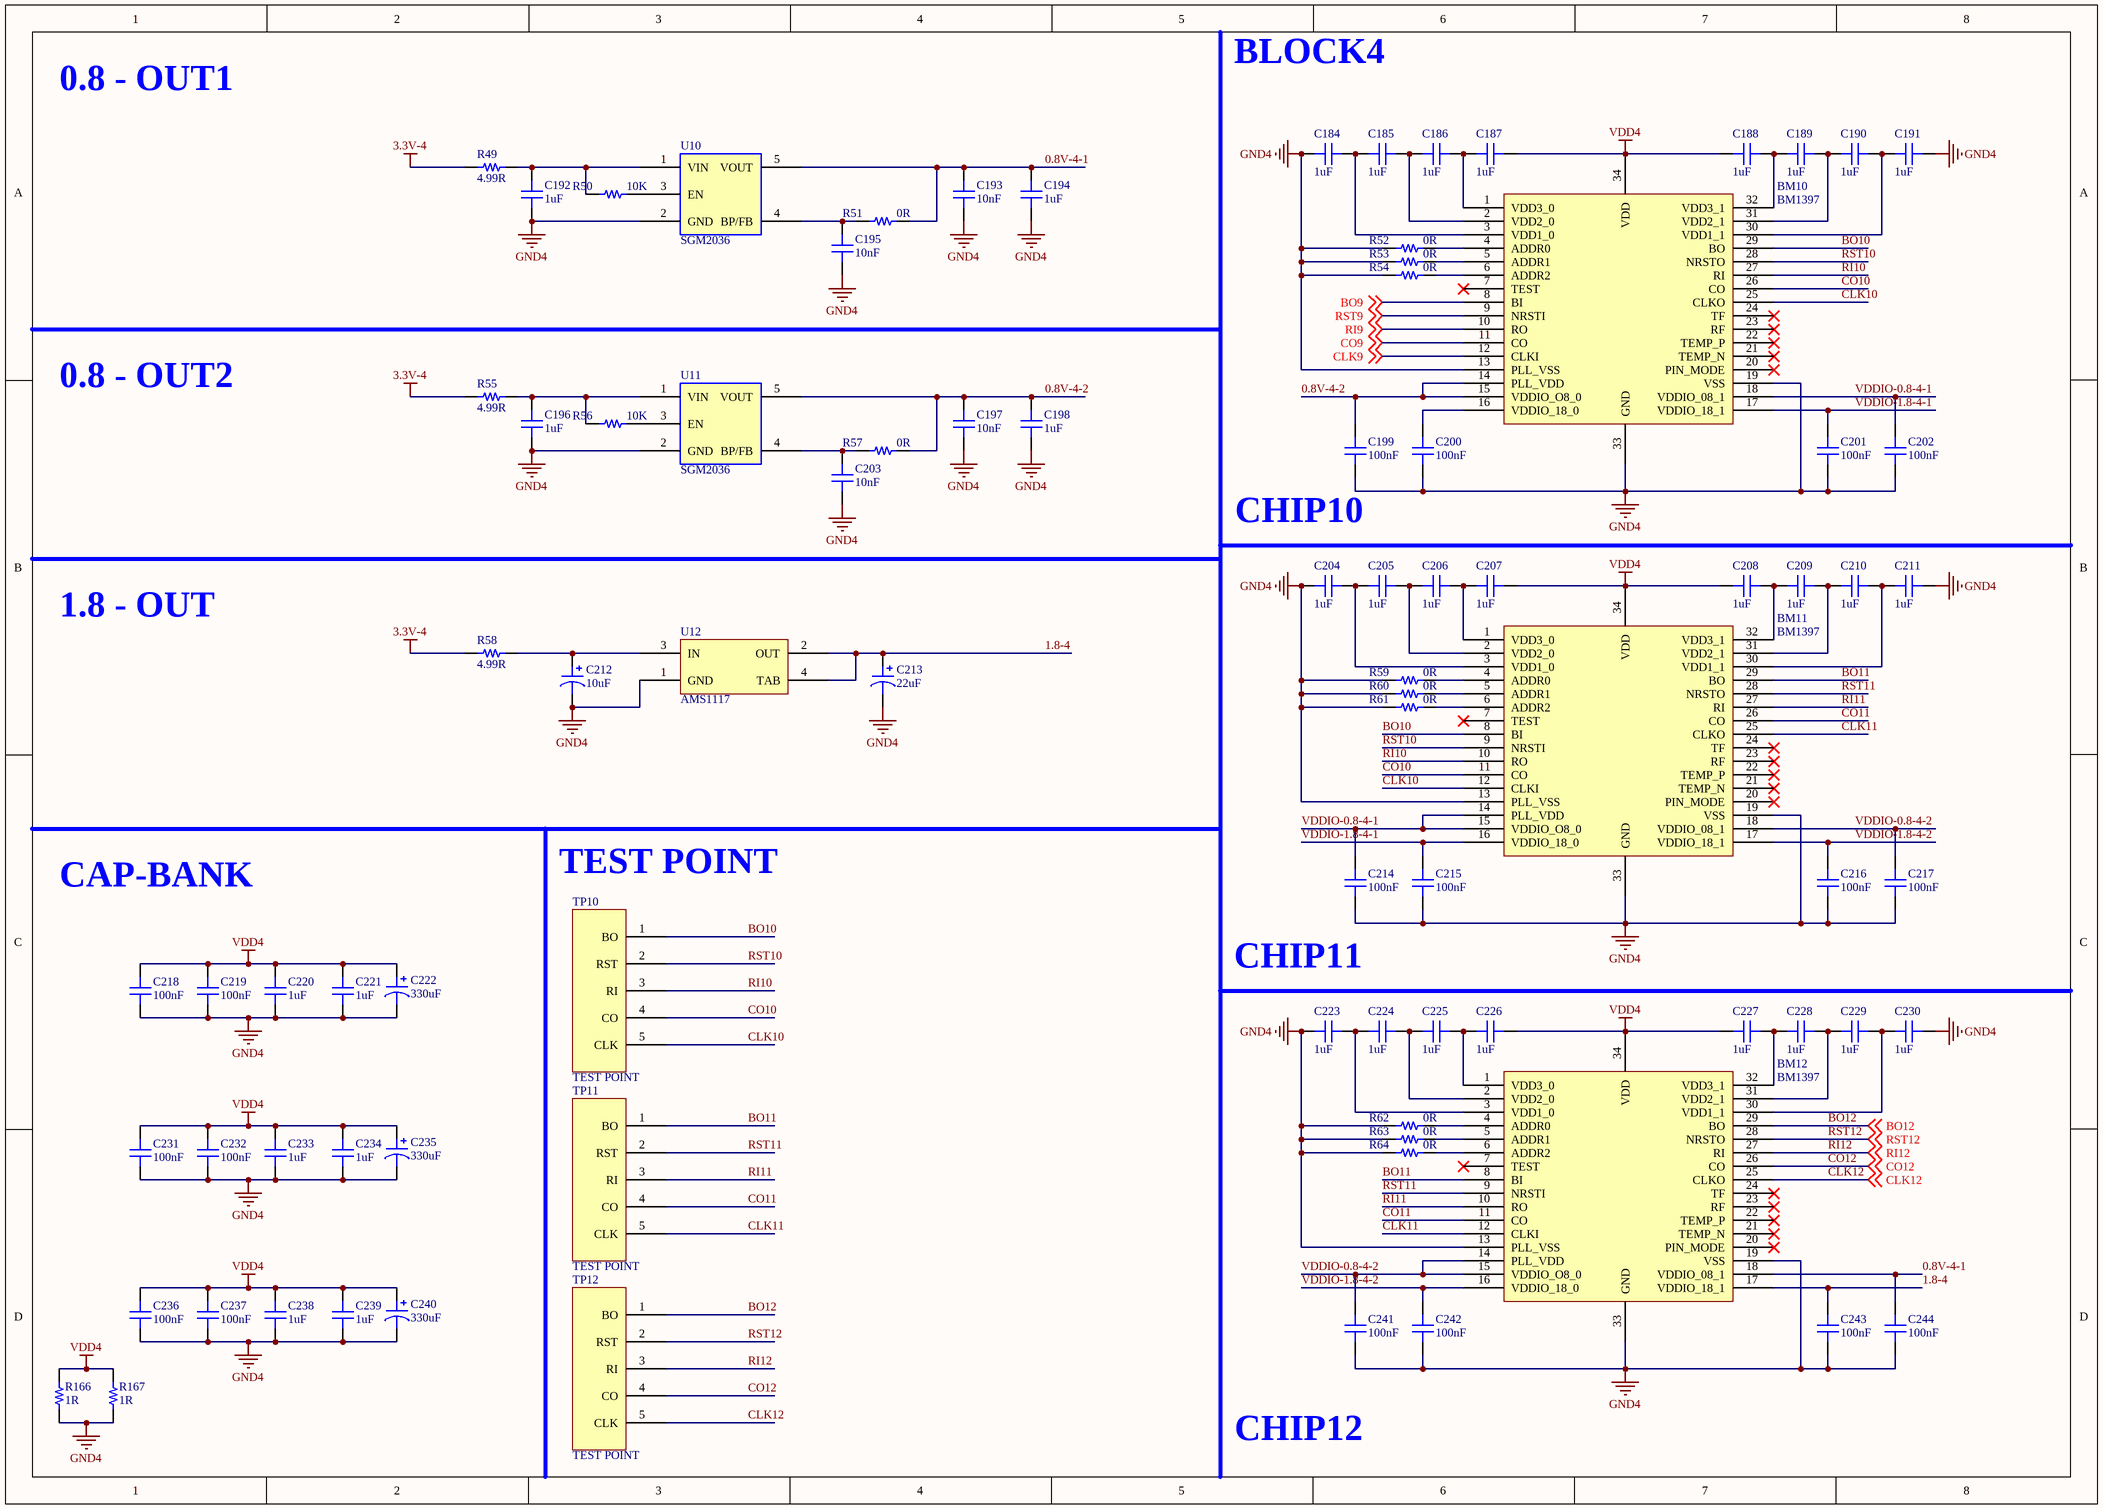
[diagram p3: BLOCK4.SchDoc]

### Parts
BM10  BM1397  [BM1387]
BM11  BM1397  [BM1387]
BM12  BM1397  [BM1387]
C184  1uF  [CAP-SMD-0603]
C185  1uF  [CAP-SMD-0603]
C186  1uF  [CAP-SMD-0603]
C187  1uF  [CAP-SMD-0603]
C188  1uF  [CAP-SMD-0603]
C189  1uF  [CAP-SMD-0603]
C190  1uF  [CAP-SMD-0603]
C191  1uF  [CAP-SMD-0603]
C192  1uF  [CAP_SMD_0805]
C193  10nF  [CAP_SMD_0805]
C194  1uF  [CAP_SMD_0805]
C195  10nF  [CAP_SMD_0805]
C196  1uF  [CAP_SMD_0805]
C197  10nF  [CAP_SMD_0805]
C198  1uF  [CAP_SMD_0805]
C199  100nF  [CAP_SMD_0805]
C200  100nF  [CAP_SMD_0805]
C201  100nF  [CAP_SMD_0805]
C202  100nF  [CAP_SMD_0805]
C203  10nF  [CAP_SMD_0805]
C204  1uF  [CAP-SMD-0603]
C205  1uF  [CAP-SMD-0603]
C206  1uF  [CAP-SMD-0603]
C207  1uF  [CAP-SMD-0603]
C208  1uF  [CAP-SMD-0603]
C209  1uF  [CAP-SMD-0603]
C210  1uF  [CAP-SMD-0603]
C211  1uF  [CAP-SMD-0603]
C212  10uF  [CAP-TAN-CASE-A]
C213  22uF  [CAP-TAN-CASE-A]
C214  100nF  [CAP_SMD_0805]
C215  100nF  [CAP_SMD_0805]
C216  100nF  [CAP_SMD_0805]
C217  100nF  [CAP_SMD_0805]
C218  100nF  [CAP_SMD_0805]
C219  100nF  [CAP_SMD_0805]
C220  1uF  [CAP_SMD_0805]
C221  1uF  [CAP_SMD_0805]
C222  330uF  [CAP-TAN-CASE-E]
C223  1uF  [CAP-SMD-0603]
C224  1uF  [CAP-SMD-0603]
C225  1uF  [CAP-SMD-0603]
C226  1uF  [CAP-SMD-0603]
C227  1uF  [CAP-SMD-0603]
C228  1uF  [CAP-SMD-0603]
C229  1uF  [CAP-SMD-0603]
C230  1uF  [CAP-SMD-0603]
C231  100nF  [CAP_SMD_0805]
C232  100nF  [CAP_SMD_0805]
C233  1uF  [CAP_SMD_0805]
C234  1uF  [CAP_SMD_0805]
C235  330uF  [CAP-TAN-CASE-E]
C236  100nF  [CAP_SMD_0805]
C237  100nF  [CAP_SMD_0805]
C238  1uF  [CAP_SMD_0805]
C239  1uF  [CAP_SMD_0805]
C240  330uF  [CAP-TAN-CASE-E]
C241  100nF  [CAP_SMD_0805]
C242  100nF  [CAP_SMD_0805]
C243  100nF  [CAP_SMD_0805]
C244  100nF  [CAP_SMD_0805]
R49  4.99R  [RES-SMD-1206]
R50  10K  [RES-SMD-0402]
R51  0R  [RES-SMD-0402]
R52  0R  [RES-SMD-0402]
R53  0R  [RES-SMD-0402]
R54  0R  [RES-SMD-0402]
R55  4.99R  [RES-SMD-1206]
R56  10K  [RES-SMD-0402]
R57  0R  [RES-SMD-0402]
R58  4.99R  [RES-SMD-1206]
R59  0R  [RES-SMD-0402]
R60  0R  [RES-SMD-0402]
R61  0R  [RES-SMD-0402]
R62  0R  [RES-SMD-0402]
R63  0R  [RES-SMD-0402]
R64  0R  [RES-SMD-0402]
R166  1R  [RES-SMD-1210]
R167  1R  [RES-SMD-1210]
TP10  TEST POINT  [TEST_POINT]
TP11  TEST POINT  [TEST_POINT]
TP12  TEST POINT  [TEST_POINT]
U10  SGM2036  [SOT23-5PIN]
U11  SGM2036  [SOT23-5PIN]
U12  AMS1117  [AMS1117]

### Nets
3.3V-4: R49.1 R55.1 R58.1
GND4: BM10.13(PLL_VSS) BM10.19(VSS) BM10.33(GND) BM11.13(PLL_VSS) BM11.19(VSS) BM11.33(GND) BM12.13(PLL_VSS) BM12.19(VSS) BM12.33(GND) C184.1 C191.2 C192.1 C193.1 C194.1 C195.1 C196.1 C197.1 C198.1 C199.1 C200.1 C201.1 C202.1 C203.1 C204.1 C211.2 C212.2 C213.2 C214.1 C215.1 C216.1 C217.1 C218.1 C219.1 C220.1 C221.1 C222.2 C223.1 C230.2 C231.1 C232.1 C233.1 C234.1 C235.2 C236.1 C237.1 C238.1 C239.1 C240.2 C241.1 C242.1 C243.1 C244.1 R52.1 R53.1 R54.1 R59.1 R60.1 R61.1 R62.1 R63.1 R64.1 R166.1 R167.1 U10.2(GND) U11.2(GND) U12.1(GND)  [project net 3.3V-2]
VDD4: BM10.34(VDD) BM11.34(VDD) BM12.34(VDD) C187.2 C188.1 C207.2 C208.1 C218.2 C219.2 C220.2 C221.2 C222.1 C226.2 C227.1 C231.2 C232.2 C233.2 C234.2 C235.1 C236.2 C237.2 C238.2 C239.2 C240.1 R166.2 R167.2  [project net 3.3V-3]
0.8V-4-1: BM12.18(VDDIO_08_1) C193.2 C194.2 C244.2 R51.2 U10.5(VOUT)
0.8V-4-2: BM10.14(PLL_VDD) BM10.15(VDDIO_O8_0) C197.2 C198.2 C199.2 R57.2 U11.5(VOUT)
1.8-4: BM12.17(VDDIO_18_1) C213.1 C243.2 U12.2(OUT) U12.4(TAB)
BO9: BM10.8(BI) ; off-sheet BO9
BO10: BM10.29(BO) BM11.8(BI) TP10.1(BO)
BO11: BM11.29(BO) BM12.8(BI) TP11.1(BO)
BO12: BM12.29(BO) TP12.1(BO) ; off-sheet BO12
CLK9: BM10.12(CLKI) ; off-sheet CLK9
CLK10: BM10.25(CLKO) BM11.12(CLKI) TP10.5(CLK)
CLK11: BM11.25(CLKO) BM12.12(CLKI) TP11.5(CLK)
CLK12: BM12.25(CLKO) TP12.5(CLK) ; off-sheet CLK12
CO9: BM10.11(CO) ; off-sheet CO9
CO10: BM10.26(CO) BM11.11(CO) TP10.4(CO)
CO11: BM11.26(CO) BM12.11(CO) TP11.4(CO)
CO12: BM12.26(CO) TP12.4(CO) ; off-sheet CO12
RI9: BM10.10(RO) ; off-sheet RI9
RI10: BM10.27(RI) BM11.10(RO) TP10.3(RI)
RI11: BM11.27(RI) BM12.10(RO) TP11.3(RI)
RI12: BM12.27(RI) TP12.3(RI) ; off-sheet RI12
RST9: BM10.9(NRSTI) ; off-sheet RST9
RST10: BM10.28(NRSTO) BM11.9(NRSTI) TP10.2(RST)
RST11: BM11.28(NRSTO) BM12.9(NRSTI) TP11.2(RST)
RST12: BM12.28(NRSTO) TP12.2(RST) ; off-sheet RST12
VDDIO-0.8-4-1: BM10.18(VDDIO_08_1) BM11.14(PLL_VDD) BM11.15(VDDIO_O8_0) C202.2 C214.2
VDDIO-0.8-4-2: BM11.18(VDDIO_08_1) BM12.14(PLL_VDD) BM12.15(VDDIO_O8_0) C217.2 C241.2
VDDIO-1.8-4-1: BM10.17(VDDIO_18_1) BM11.16(VDDIO_18_0) C201.2 C215.2
VDDIO-1.8-4-2: BM11.17(VDDIO_18_1) BM12.16(VDDIO_18_0) C216.2 C242.2
NetBM10_1: BM10.1(VDD3_0) C186.2 C187.1
NetBM10_2: BM10.2(VDD2_0) C185.2 C186.1
NetBM10_3: BM10.3(VDD1_0) C184.2 C185.1
NetBM10_4: BM10.4(ADDR0) R52.2
NetBM10_5: BM10.5(ADDR1) R53.2
NetBM10_6: BM10.6(ADDR2) R54.2
NetBM10_16: BM10.16(VDDIO_18_0) C200.2
NetBM10_30: BM10.30(VDD1_1) C190.2 C191.1
NetBM10_31: BM10.31(VDD2_1) C189.2 C190.1
NetBM10_32: BM10.32(VDD3_1) C188.2 C189.1
NetBM11_1: BM11.1(VDD3_0) C206.2 C207.1
NetBM11_2: BM11.2(VDD2_0) C205.2 C206.1
NetBM11_3: BM11.3(VDD1_0) C204.2 C205.1
NetBM11_4: BM11.4(ADDR0) R59.2
NetBM11_5: BM11.5(ADDR1) R60.2
NetBM11_6: BM11.6(ADDR2) R61.2
NetBM11_30: BM11.30(VDD1_1) C210.2 C211.1
NetBM11_31: BM11.31(VDD2_1) C209.2 C210.1
NetBM11_32: BM11.32(VDD3_1) C208.2 C209.1
NetBM12_1: BM12.1(VDD3_0) C225.2 C226.1
NetBM12_2: BM12.2(VDD2_0) C224.2 C225.1
NetBM12_3: BM12.3(VDD1_0) C223.2 C224.1
NetBM12_4: BM12.4(ADDR0) R62.2
NetBM12_5: BM12.5(ADDR1) R63.2
NetBM12_6: BM12.6(ADDR2) R64.2
NetBM12_30: BM12.30(VDD1_1) C229.2 C230.1
NetBM12_31: BM12.31(VDD2_1) C228.2 C229.1
NetBM12_32: BM12.32(VDD3_1) C227.2 C228.1
NetC192_2: C192.2 R49.2 R50.1 U10.1(VIN)
NetC195_2: C195.2 R51.1 U10.4(BP/FB)
NetC196_2: C196.2 R55.2 R56.1 U11.1(VIN)
NetC203_2: C203.2 R57.1 U11.4(BP/FB)
NetC212_1: C212.1 R58.2 U12.3(IN)
NetR50_2: R50.2 U10.3(EN)
NetR56_2: R56.2 U11.3(EN)

Not connected (* = marked no-connect by the designer): BM10 7(TEST)* 20(PIN_MODE)* 21(TEMP_N)* 22(TEMP_P)* 23(RF)* 24(TF)*; BM11 7(TEST)* 20(PIN_MODE)* 21(TEMP_N)* 22(TEMP_P)* 23(RF)* 24(TF)*; BM12 7(TEST)* 20(PIN_MODE)* 21(TEMP_N)* 22(TEMP_P)* 23(RF)* 24(TF)*

### Notes on the sheet
- 0.8 - OUT1
- BLOCK4
- 0.8 - OUT2
- (near C199) CHIP10
- 1.8 - OUT
- CAP-BANK
- TEST POINT
- CHIP11
- CHIP12

### Library data of the parts
BM10-BM12 = BM1397_1
C184-C211 C214-C221 C223-C234 C236-C239 C241-C244 = CAP
C212 C213 C222 C235 C240 = POLARIZED CAP
R49-R64 R166 R167 = RES

## Sheet BLOCK5.SchDoc
size A3; SheetNumber: 5; SheetTotal: 12
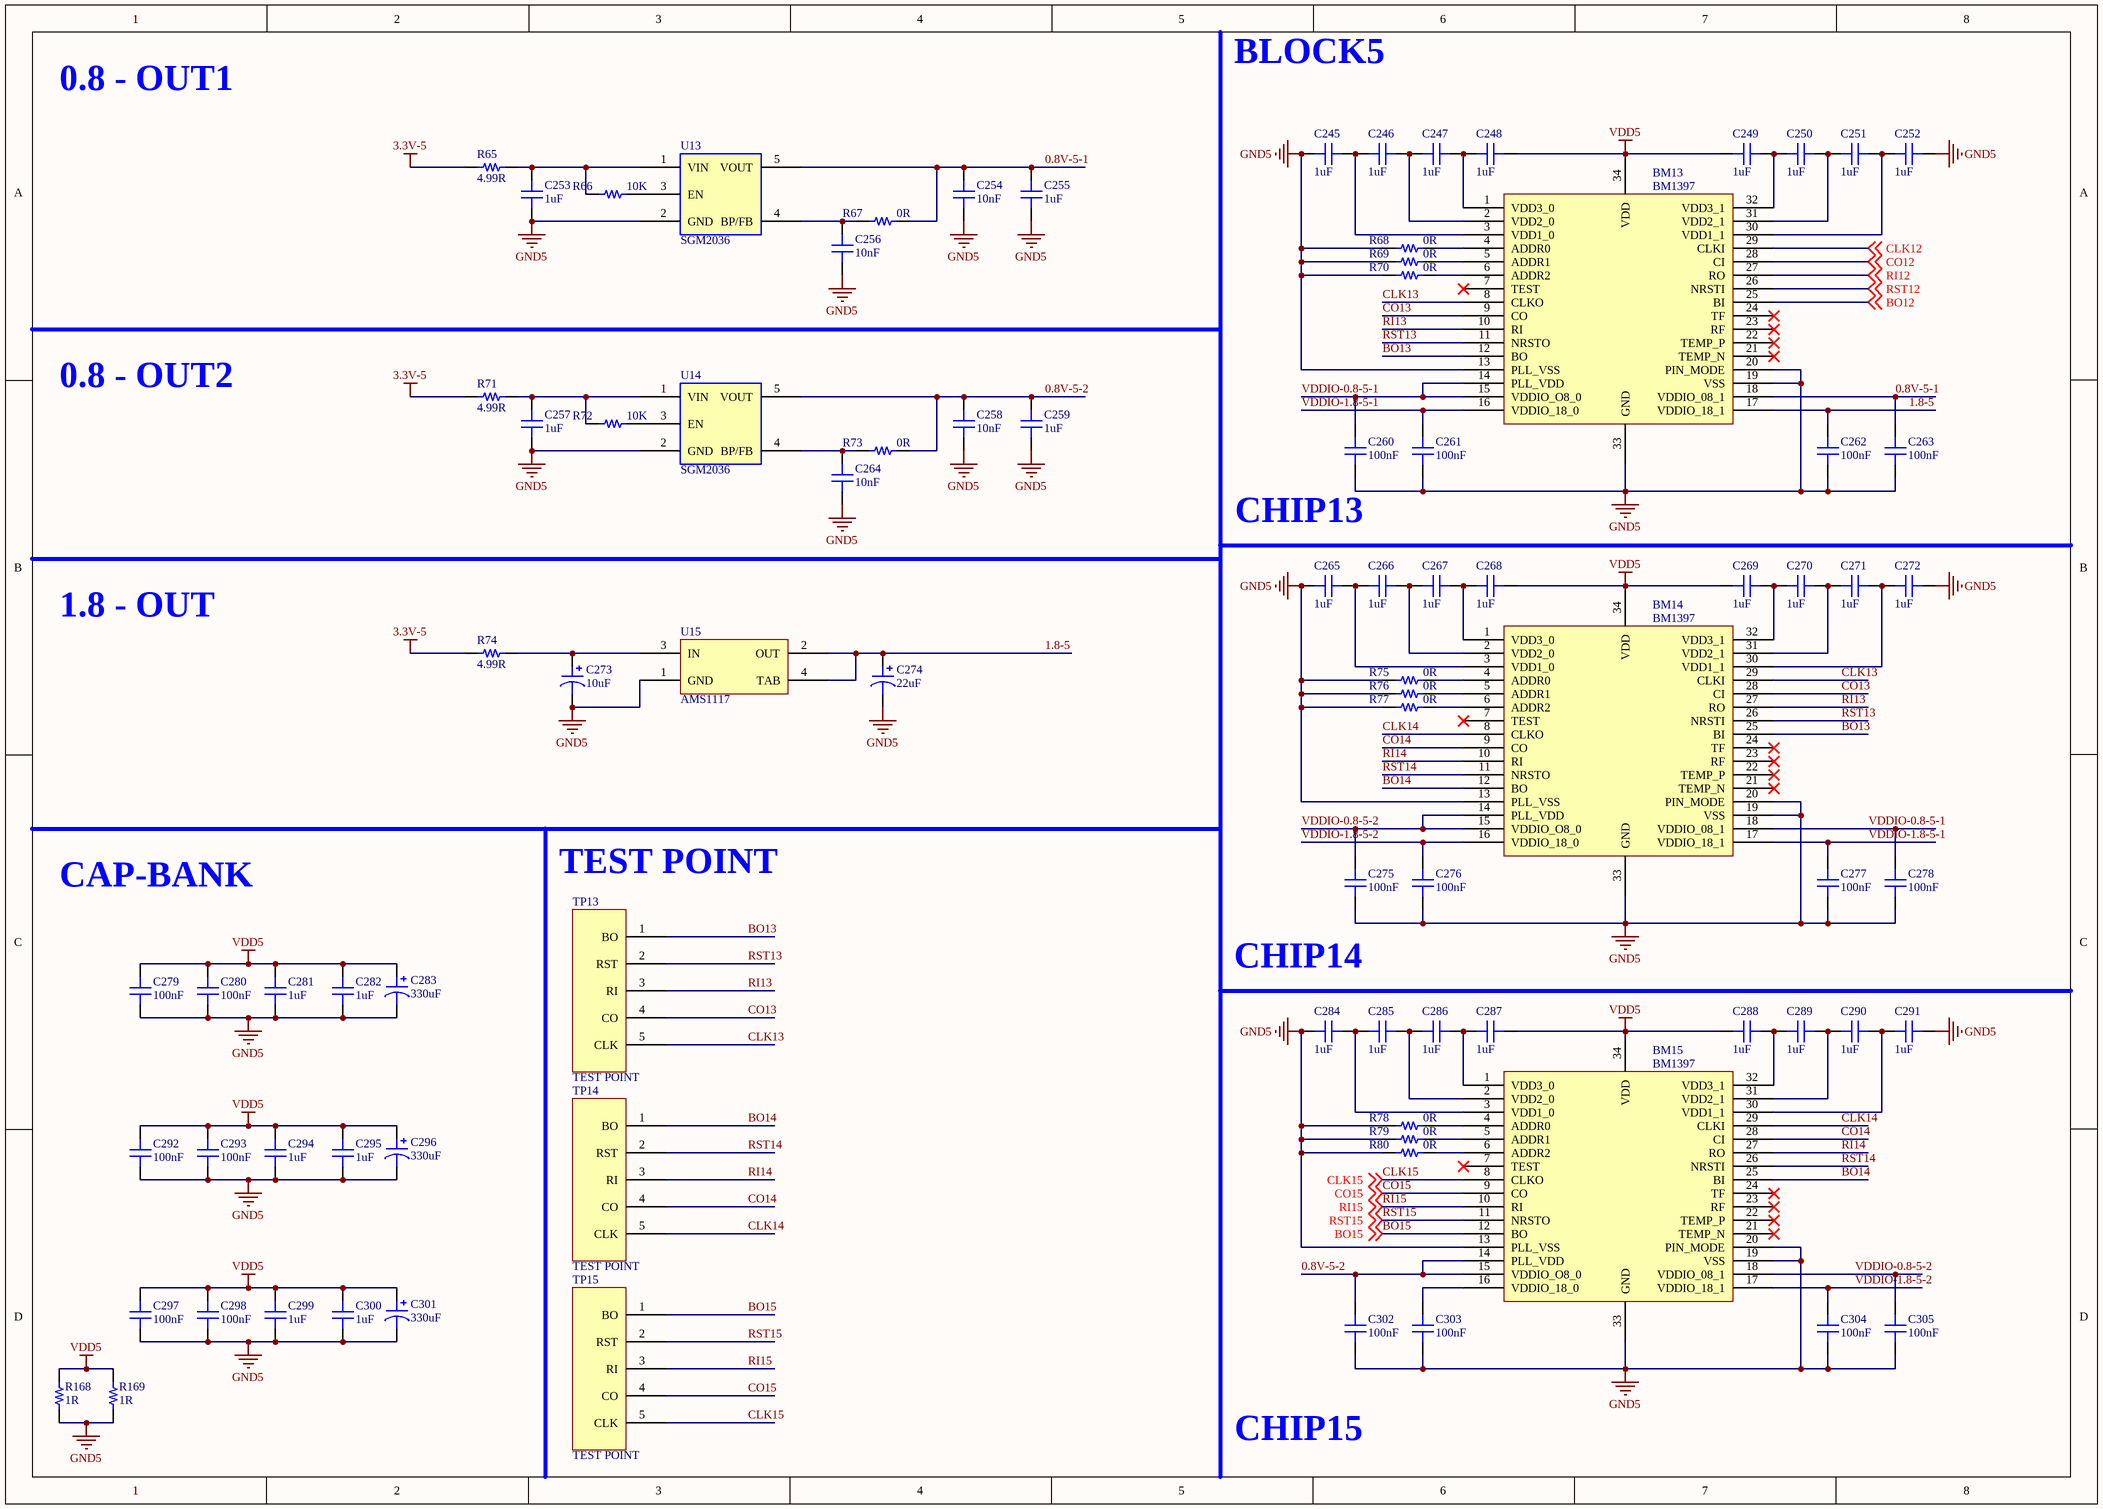
[diagram p4: BLOCK5.SchDoc]

### Parts
BM13  BM1397  [BM1387]
BM14  BM1397  [BM1387]
BM15  BM1397  [BM1387]
C245  1uF  [CAP-SMD-0603]
C246  1uF  [CAP-SMD-0603]
C247  1uF  [CAP-SMD-0603]
C248  1uF  [CAP-SMD-0603]
C249  1uF  [CAP-SMD-0603]
C250  1uF  [CAP-SMD-0603]
C251  1uF  [CAP-SMD-0603]
C252  1uF  [CAP-SMD-0603]
C253  1uF  [CAP_SMD_0805]
C254  10nF  [CAP_SMD_0805]
C255  1uF  [CAP_SMD_0805]
C256  10nF  [CAP_SMD_0805]
C257  1uF  [CAP_SMD_0805]
C258  10nF  [CAP_SMD_0805]
C259  1uF  [CAP_SMD_0805]
C260  100nF  [CAP_SMD_0805]
C261  100nF  [CAP_SMD_0805]
C262  100nF  [CAP_SMD_0805]
C263  100nF  [CAP_SMD_0805]
C264  10nF  [CAP_SMD_0805]
C265  1uF  [CAP-SMD-0603]
C266  1uF  [CAP-SMD-0603]
C267  1uF  [CAP-SMD-0603]
C268  1uF  [CAP-SMD-0603]
C269  1uF  [CAP-SMD-0603]
C270  1uF  [CAP-SMD-0603]
C271  1uF  [CAP-SMD-0603]
C272  1uF  [CAP-SMD-0603]
C273  10uF  [CAP-TAN-CASE-A]
C274  22uF  [CAP-TAN-CASE-A]
C275  100nF  [CAP_SMD_0805]
C276  100nF  [CAP_SMD_0805]
C277  100nF  [CAP_SMD_0805]
C278  100nF  [CAP_SMD_0805]
C279  100nF  [CAP_SMD_0805]
C280  100nF  [CAP_SMD_0805]
C281  1uF  [CAP_SMD_0805]
C282  1uF  [CAP_SMD_0805]
C283  330uF  [CAP-TAN-CASE-E]
C284  1uF  [CAP-SMD-0603]
C285  1uF  [CAP-SMD-0603]
C286  1uF  [CAP-SMD-0603]
C287  1uF  [CAP-SMD-0603]
C288  1uF  [CAP-SMD-0603]
C289  1uF  [CAP-SMD-0603]
C290  1uF  [CAP-SMD-0603]
C291  1uF  [CAP-SMD-0603]
C292  100nF  [CAP_SMD_0805]
C293  100nF  [CAP_SMD_0805]
C294  1uF  [CAP_SMD_0805]
C295  1uF  [CAP_SMD_0805]
C296  330uF  [CAP-TAN-CASE-E]
C297  100nF  [CAP_SMD_0805]
C298  100nF  [CAP_SMD_0805]
C299  1uF  [CAP_SMD_0805]
C300  1uF  [CAP_SMD_0805]
C301  330uF  [CAP-TAN-CASE-E]
C302  100nF  [CAP_SMD_0805]
C303  100nF  [CAP_SMD_0805]
C304  100nF  [CAP_SMD_0805]
C305  100nF  [CAP_SMD_0805]
R65  4.99R  [RES-SMD-1206]
R66  10K  [RES-SMD-0402]
R67  0R  [RES-SMD-0402]
R68  0R  [RES-SMD-0402]
R69  0R  [RES-SMD-0402]
R70  0R  [RES-SMD-0402]
R71  4.99R  [RES-SMD-1206]
R72  10K  [RES-SMD-0402]
R73  0R  [RES-SMD-0402]
R74  4.99R  [RES-SMD-1206]
R75  0R  [RES-SMD-0402]
R76  0R  [RES-SMD-0402]
R77  0R  [RES-SMD-0402]
R78  0R  [RES-SMD-0402]
R79  0R  [RES-SMD-0402]
R80  0R  [RES-SMD-0402]
R168  1R  [RES-SMD-1210]
R169  1R  [RES-SMD-1210]
TP13  TEST POINT  [TEST_POINT]
TP14  TEST POINT  [TEST_POINT]
TP15  TEST POINT  [TEST_POINT]
U13  SGM2036  [SOT23-5PIN]
U14  SGM2036  [SOT23-5PIN]
U15  AMS1117  [AMS1117]

### Nets
3.3V-5: R65.1 R71.1 R74.1
GND5: BM13.13(PLL_VSS) BM13.19(VSS) BM13.20(PIN_MODE) BM13.33(GND) BM14.13(PLL_VSS) BM14.19(VSS) BM14.20(PIN_MODE) BM14.33(GND) BM15.13(PLL_VSS) BM15.19(VSS) BM15.20(PIN_MODE) BM15.33(GND) C245.1 C252.2 C253.1 C254.1 C255.1 C256.1 C257.1 C258.1 C259.1 C260.1 C261.1 C262.1 C263.1 C264.1 C265.1 C272.2 C273.2 C274.2 C275.1 C276.1 C277.1 C278.1 C279.1 C280.1 C281.1 C282.1 C283.2 C284.1 C291.2 C292.1 C293.1 C294.1 C295.1 C296.2 C297.1 C298.1 C299.1 C300.1 C301.2 C302.1 C303.1 C304.1 C305.1 R68.1 R69.1 R70.1 R75.1 R76.1 R77.1 R78.1 R79.1 R80.1 R168.1 R169.1 U13.2(GND) U14.2(GND) U15.1(GND)  [project net 3.3V-3]
VDD5: BM13.34(VDD) BM14.34(VDD) BM15.34(VDD) C248.2 C249.1 C268.2 C269.1 C279.2 C280.2 C281.2 C282.2 C283.1 C287.2 C288.1 C292.2 C293.2 C294.2 C295.2 C296.1 C297.2 C298.2 C299.2 C300.2 C301.1 R168.2 R169.2  [project net 3.3V-4]
0.8V-5-1: BM13.18(VDDIO_08_1) C254.2 C255.2 C263.2 R67.2 U13.5(VOUT)
0.8V-5-2: BM15.14(PLL_VDD) BM15.15(VDDIO_O8_0) C258.2 C259.2 C302.2 R73.2 U14.5(VOUT)
1.8-5: BM13.17(VDDIO_18_1) C262.2 C274.1 U15.2(OUT) U15.4(TAB)
BO12: BM13.25(BI) ; off-sheet BO12
BO13: BM13.12(BO) BM14.25(BI) TP13.1(BO)
BO14: BM14.12(BO) BM15.25(BI) TP14.1(BO)
BO15: BM15.12(BO) TP15.1(BO) ; off-sheet BO15
CLK12: BM13.29(CLKI) ; off-sheet CLK12
CLK13: BM13.8(CLKO) BM14.29(CLKI) TP13.5(CLK)
CLK14: BM14.8(CLKO) BM15.29(CLKI) TP14.5(CLK)
CLK15: BM15.8(CLKO) TP15.5(CLK) ; off-sheet CLK15
CO12: BM13.28(CI) ; off-sheet CO12
CO13: BM13.9(CO) BM14.28(CI) TP13.4(CO)
CO14: BM14.9(CO) BM15.28(CI) TP14.4(CO)
CO15: BM15.9(CO) TP15.4(CO) ; off-sheet CO15
RI12: BM13.27(RO) ; off-sheet RI12
RI13: BM13.10(RI) BM14.27(RO) TP13.3(RI)
RI14: BM14.10(RI) BM15.27(RO) TP14.3(RI)
RI15: BM15.10(RI) TP15.3(RI) ; off-sheet RI15
RST12: BM13.26(NRSTI) ; off-sheet RST12
RST13: BM13.11(NRSTO) BM14.26(NRSTI) TP13.2(RST)
RST14: BM14.11(NRSTO) BM15.26(NRSTI) TP14.2(RST)
RST15: BM15.11(NRSTO) TP15.2(RST) ; off-sheet RST15
VDDIO-0.8-5-1: BM13.14(PLL_VDD) BM13.15(VDDIO_O8_0) BM14.18(VDDIO_08_1) C260.2 C278.2
VDDIO-0.8-5-2: BM14.14(PLL_VDD) BM14.15(VDDIO_O8_0) BM15.18(VDDIO_08_1) C275.2 C305.2
VDDIO-1.8-5-1: BM13.16(VDDIO_18_0) BM14.17(VDDIO_18_1) C261.2 C277.2
VDDIO-1.8-5-2: BM14.16(VDDIO_18_0) BM15.17(VDDIO_18_1) C276.2 C304.2
NetBM13_1: BM13.1(VDD3_0) C247.2 C248.1
NetBM13_2: BM13.2(VDD2_0) C246.2 C247.1
NetBM13_3: BM13.3(VDD1_0) C245.2 C246.1
NetBM13_4: BM13.4(ADDR0) R68.2
NetBM13_5: BM13.5(ADDR1) R69.2
NetBM13_6: BM13.6(ADDR2) R70.2
NetBM13_30: BM13.30(VDD1_1) C251.2 C252.1
NetBM13_31: BM13.31(VDD2_1) C250.2 C251.1
NetBM13_32: BM13.32(VDD3_1) C249.2 C250.1
NetBM14_1: BM14.1(VDD3_0) C267.2 C268.1
NetBM14_2: BM14.2(VDD2_0) C266.2 C267.1
NetBM14_3: BM14.3(VDD1_0) C265.2 C266.1
NetBM14_4: BM14.4(ADDR0) R75.2
NetBM14_5: BM14.5(ADDR1) R76.2
NetBM14_6: BM14.6(ADDR2) R77.2
NetBM14_30: BM14.30(VDD1_1) C271.2 C272.1
NetBM14_31: BM14.31(VDD2_1) C270.2 C271.1
NetBM14_32: BM14.32(VDD3_1) C269.2 C270.1
NetBM15_1: BM15.1(VDD3_0) C286.2 C287.1
NetBM15_2: BM15.2(VDD2_0) C285.2 C286.1
NetBM15_3: BM15.3(VDD1_0) C284.2 C285.1
NetBM15_4: BM15.4(ADDR0) R78.2
NetBM15_5: BM15.5(ADDR1) R79.2
NetBM15_6: BM15.6(ADDR2) R80.2
NetBM15_16: BM15.16(VDDIO_18_0) C303.2
NetBM15_30: BM15.30(VDD1_1) C290.2 C291.1
NetBM15_31: BM15.31(VDD2_1) C289.2 C290.1
NetBM15_32: BM15.32(VDD3_1) C288.2 C289.1
NetC253_2: C253.2 R65.2 R66.1 U13.1(VIN)
NetC256_2: C256.2 R67.1 U13.4(BP/FB)
NetC257_2: C257.2 R71.2 R72.1 U14.1(VIN)
NetC264_2: C264.2 R73.1 U14.4(BP/FB)
NetC273_1: C273.1 R74.2 U15.3(IN)
NetR66_2: R66.2 U13.3(EN)
NetR72_2: R72.2 U14.3(EN)

Not connected (* = marked no-connect by the designer): BM13 7(TEST)* 21(TEMP_N)* 22(TEMP_P)* 23(RF)* 24(TF)*; BM14 7(TEST)* 21(TEMP_N)* 22(TEMP_P)* 23(RF)* 24(TF)*; BM15 7(TEST)* 21(TEMP_N)* 22(TEMP_P)* 23(RF)* 24(TF)*

### Notes on the sheet
- 0.8 - OUT1
- BLOCK5
- 0.8 - OUT2
- (near C260) CHIP13
- 1.8 - OUT
- CAP-BANK
- TEST POINT
- CHIP14
- CHIP15

### Library data of the parts
BM13-BM15 = BM1397_0
C245-C272 C275-C282 C284-C295 C297-C300 C302-C305 = CAP
C273 C274 C283 C296 C301 = POLARIZED CAP
R65-R80 R168 R169 = RES

## Sheet BLOCK6.SchDoc
size A3; SheetNumber: 6; SheetTotal: 12
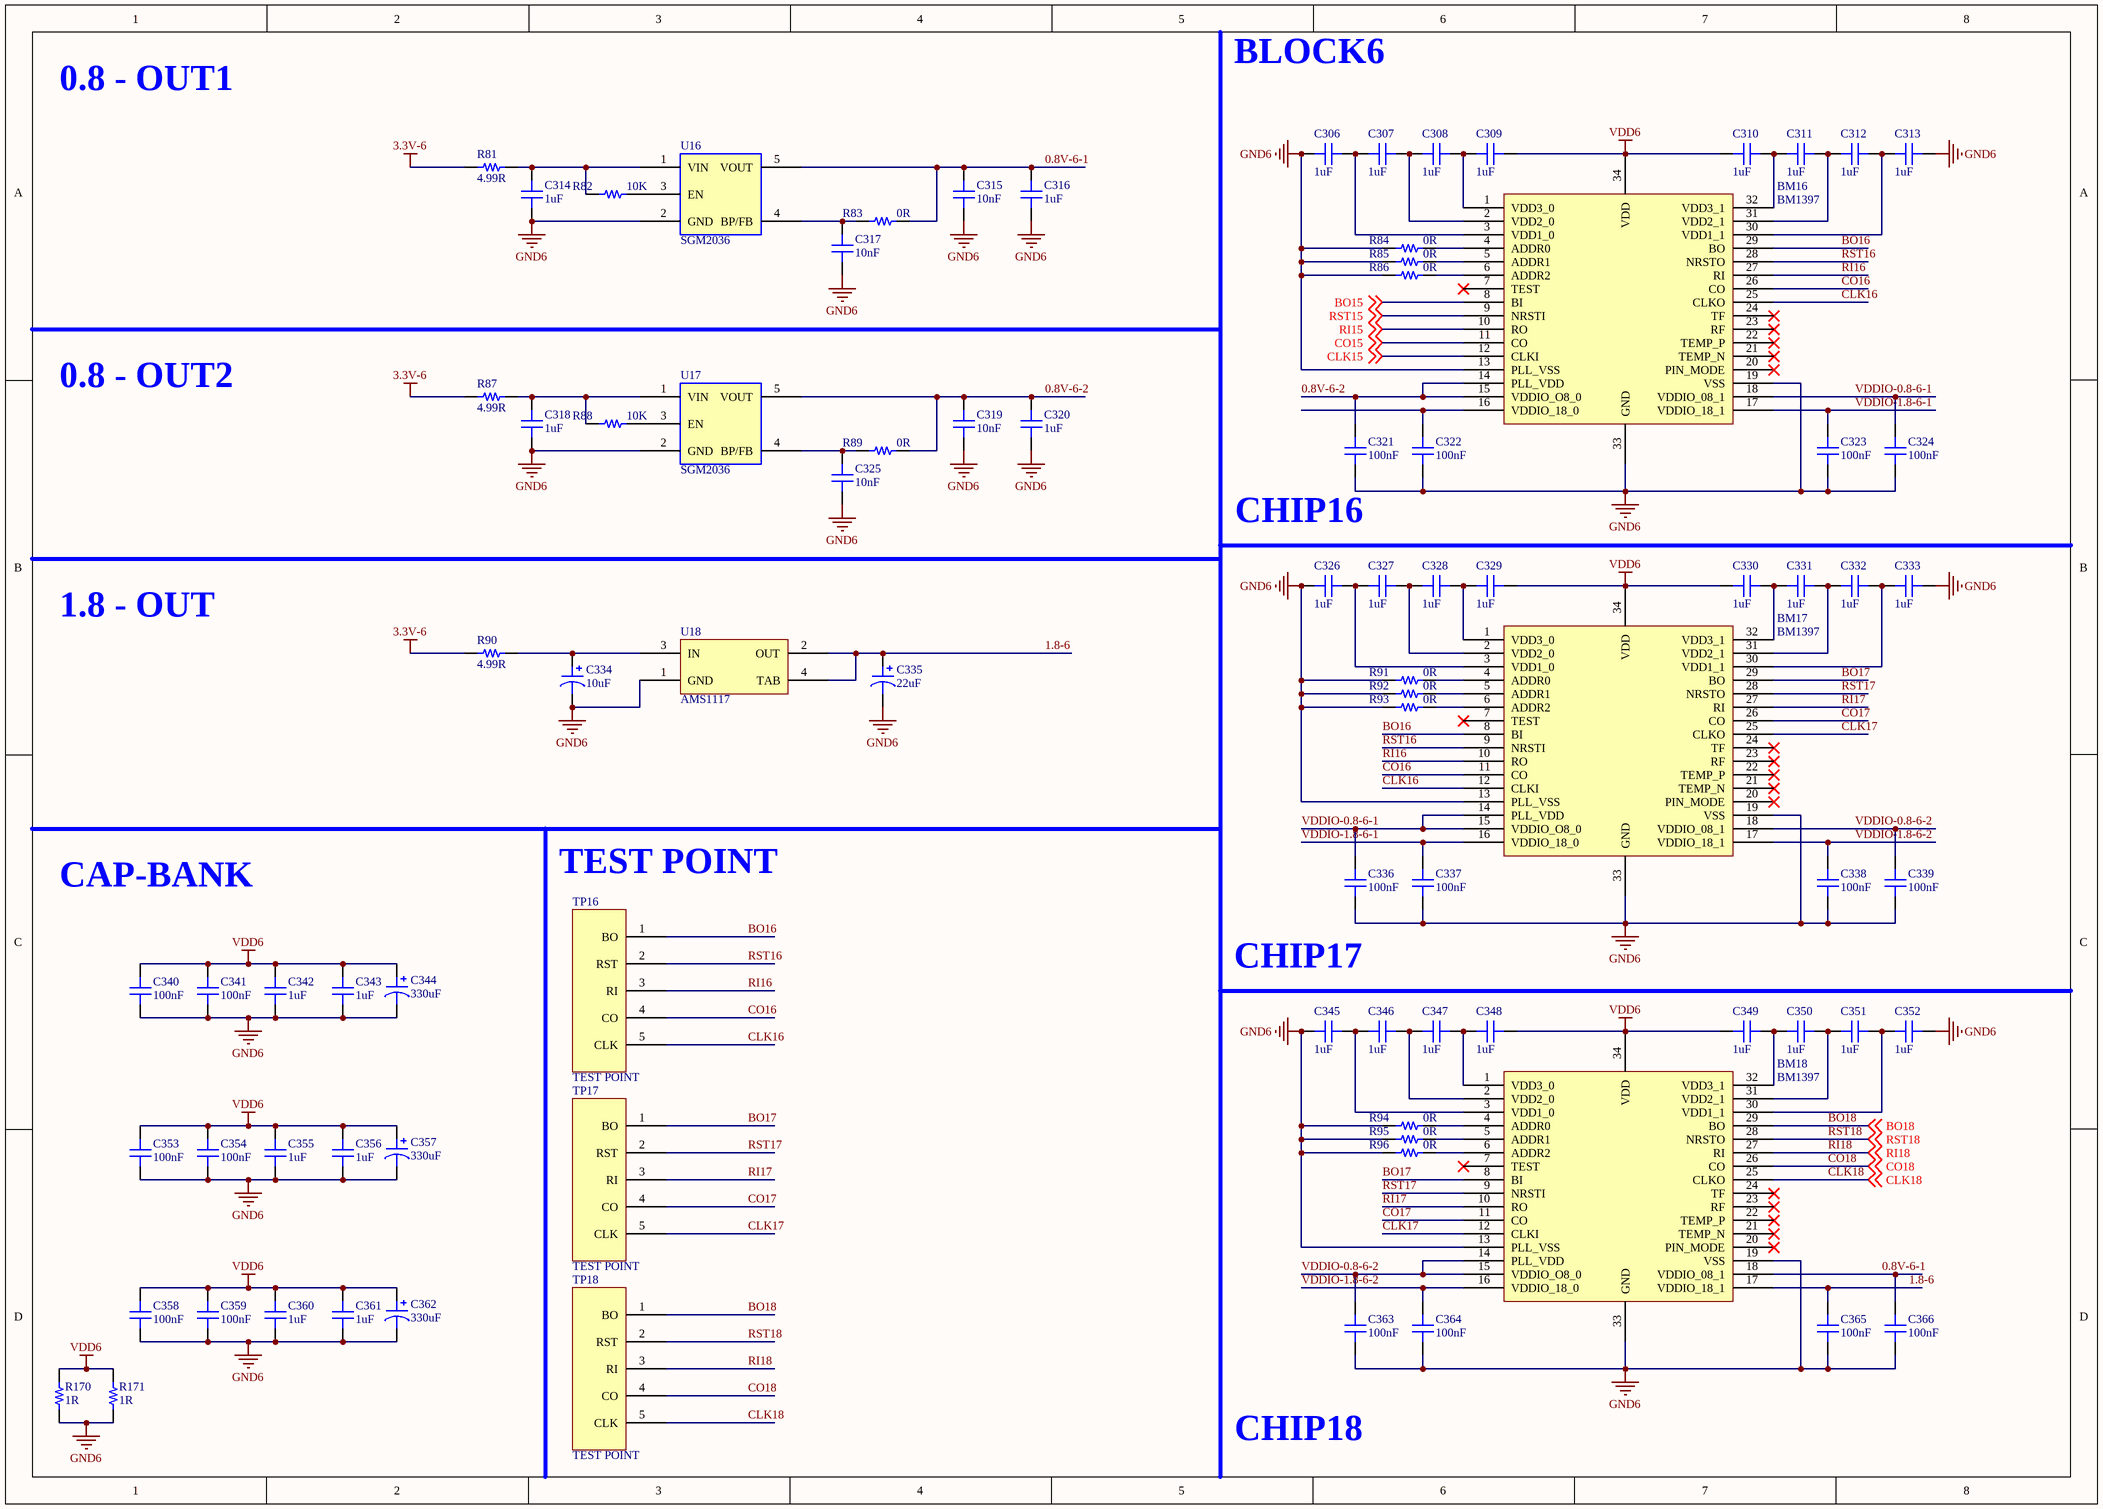
[diagram p5: BLOCK6.SchDoc]

### Parts
BM16  BM1397  [BM1387]
BM17  BM1397  [BM1387]
BM18  BM1397  [BM1387]
C306  1uF  [CAP-SMD-0603]
C307  1uF  [CAP-SMD-0603]
C308  1uF  [CAP-SMD-0603]
C309  1uF  [CAP-SMD-0603]
C310  1uF  [CAP-SMD-0603]
C311  1uF  [CAP-SMD-0603]
C312  1uF  [CAP-SMD-0603]
C313  1uF  [CAP-SMD-0603]
C314  1uF  [CAP_SMD_0805]
C315  10nF  [CAP_SMD_0805]
C316  1uF  [CAP_SMD_0805]
C317  10nF  [CAP_SMD_0805]
C318  1uF  [CAP_SMD_0805]
C319  10nF  [CAP_SMD_0805]
C320  1uF  [CAP_SMD_0805]
C321  100nF  [CAP_SMD_0805]
C322  100nF  [CAP_SMD_0805]
C323  100nF  [CAP_SMD_0805]
C324  100nF  [CAP_SMD_0805]
C325  10nF  [CAP_SMD_0805]
C326  1uF  [CAP-SMD-0603]
C327  1uF  [CAP-SMD-0603]
C328  1uF  [CAP-SMD-0603]
C329  1uF  [CAP-SMD-0603]
C330  1uF  [CAP-SMD-0603]
C331  1uF  [CAP-SMD-0603]
C332  1uF  [CAP-SMD-0603]
C333  1uF  [CAP-SMD-0603]
C334  10uF  [CAP-TAN-CASE-A]
C335  22uF  [CAP-TAN-CASE-A]
C336  100nF  [CAP_SMD_0805]
C337  100nF  [CAP_SMD_0805]
C338  100nF  [CAP_SMD_0805]
C339  100nF  [CAP_SMD_0805]
C340  100nF  [CAP_SMD_0805]
C341  100nF  [CAP_SMD_0805]
C342  1uF  [CAP_SMD_0805]
C343  1uF  [CAP_SMD_0805]
C344  330uF  [CAP-TAN-CASE-E]
C345  1uF  [CAP-SMD-0603]
C346  1uF  [CAP-SMD-0603]
C347  1uF  [CAP-SMD-0603]
C348  1uF  [CAP-SMD-0603]
C349  1uF  [CAP-SMD-0603]
C350  1uF  [CAP-SMD-0603]
C351  1uF  [CAP-SMD-0603]
C352  1uF  [CAP-SMD-0603]
C353  100nF  [CAP_SMD_0805]
C354  100nF  [CAP_SMD_0805]
C355  1uF  [CAP_SMD_0805]
C356  1uF  [CAP_SMD_0805]
C357  330uF  [CAP-TAN-CASE-E]
C358  100nF  [CAP_SMD_0805]
C359  100nF  [CAP_SMD_0805]
C360  1uF  [CAP_SMD_0805]
C361  1uF  [CAP_SMD_0805]
C362  330uF  [CAP-TAN-CASE-E]
C363  100nF  [CAP_SMD_0805]
C364  100nF  [CAP_SMD_0805]
C365  100nF  [CAP_SMD_0805]
C366  100nF  [CAP_SMD_0805]
R81  4.99R  [RES-SMD-1206]
R82  10K  [RES-SMD-0402]
R83  0R  [RES-SMD-0402]
R84  0R  [RES-SMD-0402]
R85  0R  [RES-SMD-0402]
R86  0R  [RES-SMD-0402]
R87  4.99R  [RES-SMD-1206]
R88  10K  [RES-SMD-0402]
R89  0R  [RES-SMD-0402]
R90  4.99R  [RES-SMD-1206]
R91  0R  [RES-SMD-0402]
R92  0R  [RES-SMD-0402]
R93  0R  [RES-SMD-0402]
R94  0R  [RES-SMD-0402]
R95  0R  [RES-SMD-0402]
R96  0R  [RES-SMD-0402]
R170  1R  [RES-SMD-1210]
R171  1R  [RES-SMD-1210]
TP16  TEST POINT  [TEST_POINT]
TP17  TEST POINT  [TEST_POINT]
TP18  TEST POINT  [TEST_POINT]
U16  SGM2036  [SOT23-5PIN]
U17  SGM2036  [SOT23-5PIN]
U18  AMS1117  [AMS1117]

### Nets
3.3V-6: R81.1 R87.1 R90.1
GND6: BM16.13(PLL_VSS) BM16.19(VSS) BM16.33(GND) BM17.13(PLL_VSS) BM17.19(VSS) BM17.33(GND) BM18.13(PLL_VSS) BM18.19(VSS) BM18.33(GND) C306.1 C313.2 C314.1 C315.1 C316.1 C317.1 C318.1 C319.1 C320.1 C321.1 C322.1 C323.1 C324.1 C325.1 C326.1 C333.2 C334.2 C335.2 C336.1 C337.1 C338.1 C339.1 C340.1 C341.1 C342.1 C343.1 C344.2 C345.1 C352.2 C353.1 C354.1 C355.1 C356.1 C357.2 C358.1 C359.1 C360.1 C361.1 C362.2 C363.1 C364.1 C365.1 C366.1 R84.1 R85.1 R86.1 R91.1 R92.1 R93.1 R94.1 R95.1 R96.1 R170.1 R171.1 U16.2(GND) U17.2(GND) U18.1(GND)  [project net 3.3V-4]
VDD6: BM16.34(VDD) BM17.34(VDD) BM18.34(VDD) C309.2 C310.1 C329.2 C330.1 C340.2 C341.2 C342.2 C343.2 C344.1 C348.2 C349.1 C353.2 C354.2 C355.2 C356.2 C357.1 C358.2 C359.2 C360.2 C361.2 C362.1 R170.2 R171.2  [project net 3.3V-5]
0.8V-6-1: BM18.18(VDDIO_08_1) C315.2 C316.2 C366.2 R83.2 U16.5(VOUT)
0.8V-6-2: BM16.14(PLL_VDD) BM16.15(VDDIO_O8_0) C319.2 C320.2 C321.2 R89.2 U17.5(VOUT)
1.8-6: BM18.17(VDDIO_18_1) C335.1 C365.2 U18.2(OUT) U18.4(TAB)
BO15: BM16.8(BI) ; off-sheet BO15
BO16: BM16.29(BO) BM17.8(BI) TP16.1(BO)
BO17: BM17.29(BO) BM18.8(BI) TP17.1(BO)
BO18: BM18.29(BO) TP18.1(BO) ; off-sheet BO18
CLK15: BM16.12(CLKI) ; off-sheet CLK15
CLK16: BM16.25(CLKO) BM17.12(CLKI) TP16.5(CLK)
CLK17: BM17.25(CLKO) BM18.12(CLKI) TP17.5(CLK)
CLK18: BM18.25(CLKO) TP18.5(CLK) ; off-sheet CLK18
CO15: BM16.11(CO) ; off-sheet CO15
CO16: BM16.26(CO) BM17.11(CO) TP16.4(CO)
CO17: BM17.26(CO) BM18.11(CO) TP17.4(CO)
CO18: BM18.26(CO) TP18.4(CO) ; off-sheet CO18
RI15: BM16.10(RO) ; off-sheet RI15
RI16: BM16.27(RI) BM17.10(RO) TP16.3(RI)
RI17: BM17.27(RI) BM18.10(RO) TP17.3(RI)
RI18: BM18.27(RI) TP18.3(RI) ; off-sheet RI18
RST15: BM16.9(NRSTI) ; off-sheet RST15
RST16: BM16.28(NRSTO) BM17.9(NRSTI) TP16.2(RST)
RST17: BM17.28(NRSTO) BM18.9(NRSTI) TP17.2(RST)
RST18: BM18.28(NRSTO) TP18.2(RST) ; off-sheet RST18
VDDIO-0.8-6-1: BM16.18(VDDIO_08_1) BM17.14(PLL_VDD) BM17.15(VDDIO_O8_0) C324.2 C336.2
VDDIO-0.8-6-2: BM17.18(VDDIO_08_1) BM18.14(PLL_VDD) BM18.15(VDDIO_O8_0) C339.2 C363.2
VDDIO-1.8-6-1: BM16.17(VDDIO_18_1) BM17.16(VDDIO_18_0) C323.2 C337.2
VDDIO-1.8-6-2: BM17.17(VDDIO_18_1) BM18.16(VDDIO_18_0) C338.2 C364.2
NetBM16_1: BM16.1(VDD3_0) C308.2 C309.1
NetBM16_2: BM16.2(VDD2_0) C307.2 C308.1
NetBM16_3: BM16.3(VDD1_0) C306.2 C307.1
NetBM16_4: BM16.4(ADDR0) R84.2
NetBM16_5: BM16.5(ADDR1) R85.2
NetBM16_6: BM16.6(ADDR2) R86.2
NetBM16_16: BM16.16(VDDIO_18_0) C322.2
NetBM16_30: BM16.30(VDD1_1) C312.2 C313.1
NetBM16_31: BM16.31(VDD2_1) C311.2 C312.1
NetBM16_32: BM16.32(VDD3_1) C310.2 C311.1
NetBM17_1: BM17.1(VDD3_0) C328.2 C329.1
NetBM17_2: BM17.2(VDD2_0) C327.2 C328.1
NetBM17_3: BM17.3(VDD1_0) C326.2 C327.1
NetBM17_4: BM17.4(ADDR0) R91.2
NetBM17_5: BM17.5(ADDR1) R92.2
NetBM17_6: BM17.6(ADDR2) R93.2
NetBM17_30: BM17.30(VDD1_1) C332.2 C333.1
NetBM17_31: BM17.31(VDD2_1) C331.2 C332.1
NetBM17_32: BM17.32(VDD3_1) C330.2 C331.1
NetBM18_1: BM18.1(VDD3_0) C347.2 C348.1
NetBM18_2: BM18.2(VDD2_0) C346.2 C347.1
NetBM18_3: BM18.3(VDD1_0) C345.2 C346.1
NetBM18_4: BM18.4(ADDR0) R94.2
NetBM18_5: BM18.5(ADDR1) R95.2
NetBM18_6: BM18.6(ADDR2) R96.2
NetBM18_30: BM18.30(VDD1_1) C351.2 C352.1
NetBM18_31: BM18.31(VDD2_1) C350.2 C351.1
NetBM18_32: BM18.32(VDD3_1) C349.2 C350.1
NetC314_2: C314.2 R81.2 R82.1 U16.1(VIN)
NetC317_2: C317.2 R83.1 U16.4(BP/FB)
NetC318_2: C318.2 R87.2 R88.1 U17.1(VIN)
NetC325_2: C325.2 R89.1 U17.4(BP/FB)
NetC334_1: C334.1 R90.2 U18.3(IN)
NetR82_2: R82.2 U16.3(EN)
NetR88_2: R88.2 U17.3(EN)

Not connected (* = marked no-connect by the designer): BM16 7(TEST)* 20(PIN_MODE)* 21(TEMP_N)* 22(TEMP_P)* 23(RF)* 24(TF)*; BM17 7(TEST)* 20(PIN_MODE)* 21(TEMP_N)* 22(TEMP_P)* 23(RF)* 24(TF)*; BM18 7(TEST)* 20(PIN_MODE)* 21(TEMP_N)* 22(TEMP_P)* 23(RF)* 24(TF)*

### Notes on the sheet
- 0.8 - OUT1
- BLOCK6
- 0.8 - OUT2
- (near C321) CHIP16
- 1.8 - OUT
- CAP-BANK
- TEST POINT
- CHIP17
- CHIP18

### Library data of the parts
BM16-BM18 = BM1397_1
C306-C333 C336-C343 C345-C356 C358-C361 C363-C366 = CAP
C334 C335 C344 C357 C362 = POLARIZED CAP
R81-R96 R170 R171 = RES

## Sheet BLOCK7.SchDoc
size A3; SheetNumber: 7; SheetTotal: 12
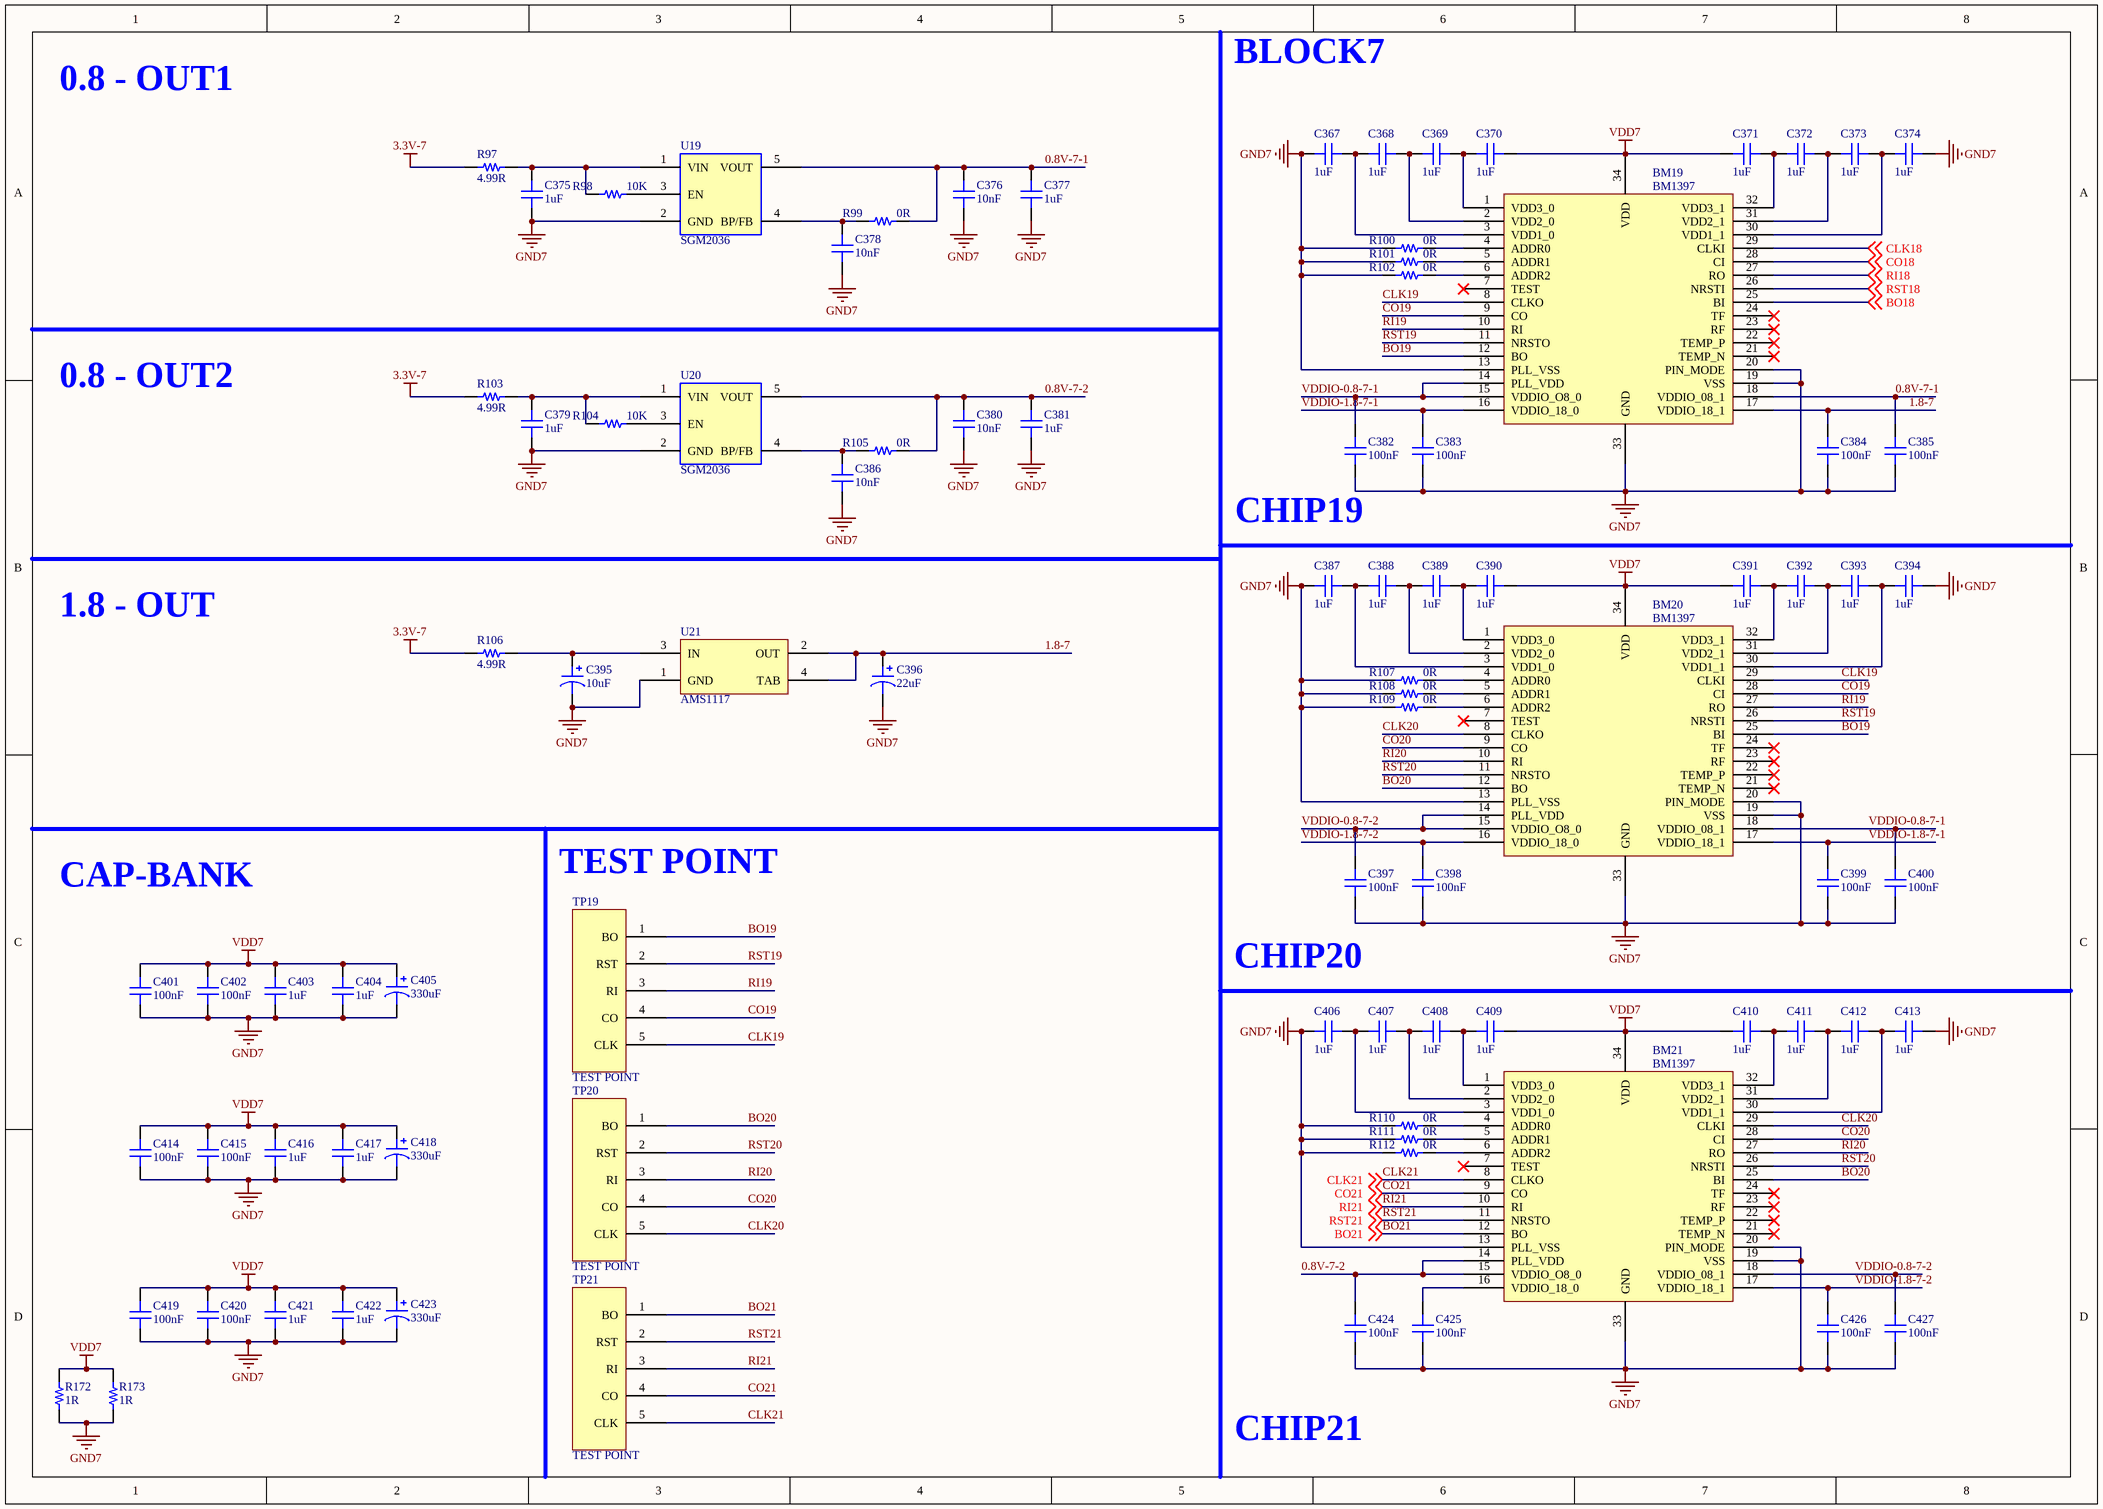
[diagram p6: BLOCK7.SchDoc]

### Parts
BM19  BM1397  [BM1387]
BM20  BM1397  [BM1387]
BM21  BM1397  [BM1387]
C367  1uF  [CAP-SMD-0603]
C368  1uF  [CAP-SMD-0603]
C369  1uF  [CAP-SMD-0603]
C370  1uF  [CAP-SMD-0603]
C371  1uF  [CAP-SMD-0603]
C372  1uF  [CAP-SMD-0603]
C373  1uF  [CAP-SMD-0603]
C374  1uF  [CAP-SMD-0603]
C375  1uF  [CAP_SMD_0805]
C376  10nF  [CAP_SMD_0805]
C377  1uF  [CAP_SMD_0805]
C378  10nF  [CAP_SMD_0805]
C379  1uF  [CAP_SMD_0805]
C380  10nF  [CAP_SMD_0805]
C381  1uF  [CAP_SMD_0805]
C382  100nF  [CAP_SMD_0805]
C383  100nF  [CAP_SMD_0805]
C384  100nF  [CAP_SMD_0805]
C385  100nF  [CAP_SMD_0805]
C386  10nF  [CAP_SMD_0805]
C387  1uF  [CAP-SMD-0603]
C388  1uF  [CAP-SMD-0603]
C389  1uF  [CAP-SMD-0603]
C390  1uF  [CAP-SMD-0603]
C391  1uF  [CAP-SMD-0603]
C392  1uF  [CAP-SMD-0603]
C393  1uF  [CAP-SMD-0603]
C394  1uF  [CAP-SMD-0603]
C395  10uF  [CAP-TAN-CASE-A]
C396  22uF  [CAP-TAN-CASE-A]
C397  100nF  [CAP_SMD_0805]
C398  100nF  [CAP_SMD_0805]
C399  100nF  [CAP_SMD_0805]
C400  100nF  [CAP_SMD_0805]
C401  100nF  [CAP_SMD_0805]
C402  100nF  [CAP_SMD_0805]
C403  1uF  [CAP_SMD_0805]
C404  1uF  [CAP_SMD_0805]
C405  330uF  [CAP-TAN-CASE-E]
C406  1uF  [CAP-SMD-0603]
C407  1uF  [CAP-SMD-0603]
C408  1uF  [CAP-SMD-0603]
C409  1uF  [CAP-SMD-0603]
C410  1uF  [CAP-SMD-0603]
C411  1uF  [CAP-SMD-0603]
C412  1uF  [CAP-SMD-0603]
C413  1uF  [CAP-SMD-0603]
C414  100nF  [CAP_SMD_0805]
C415  100nF  [CAP_SMD_0805]
C416  1uF  [CAP_SMD_0805]
C417  1uF  [CAP_SMD_0805]
C418  330uF  [CAP-TAN-CASE-E]
C419  100nF  [CAP_SMD_0805]
C420  100nF  [CAP_SMD_0805]
C421  1uF  [CAP_SMD_0805]
C422  1uF  [CAP_SMD_0805]
C423  330uF  [CAP-TAN-CASE-E]
C424  100nF  [CAP_SMD_0805]
C425  100nF  [CAP_SMD_0805]
C426  100nF  [CAP_SMD_0805]
C427  100nF  [CAP_SMD_0805]
R97  4.99R  [RES-SMD-1206]
R98  10K  [RES-SMD-0402]
R99  0R  [RES-SMD-0402]
R100  0R  [RES-SMD-0402]
R101  0R  [RES-SMD-0402]
R102  0R  [RES-SMD-0402]
R103  4.99R  [RES-SMD-1206]
R104  10K  [RES-SMD-0402]
R105  0R  [RES-SMD-0402]
R106  4.99R  [RES-SMD-1206]
R107  0R  [RES-SMD-0402]
R108  0R  [RES-SMD-0402]
R109  0R  [RES-SMD-0402]
R110  0R  [RES-SMD-0402]
R111  0R  [RES-SMD-0402]
R112  0R  [RES-SMD-0402]
R172  1R  [RES-SMD-1210]
R173  1R  [RES-SMD-1210]
TP19  TEST POINT  [TEST_POINT]
TP20  TEST POINT  [TEST_POINT]
TP21  TEST POINT  [TEST_POINT]
U19  SGM2036  [SOT23-5PIN]
U20  SGM2036  [SOT23-5PIN]
U21  AMS1117  [AMS1117]

### Nets
3.3V-7: R97.1 R103.1 R106.1  [project net 12V]
GND7: BM19.13(PLL_VSS) BM19.19(VSS) BM19.20(PIN_MODE) BM19.33(GND) BM20.13(PLL_VSS) BM20.19(VSS) BM20.20(PIN_MODE) BM20.33(GND) BM21.13(PLL_VSS) BM21.19(VSS) BM21.20(PIN_MODE) BM21.33(GND) C367.1 C374.2 C375.1 C376.1 C377.1 C378.1 C379.1 C380.1 C381.1 C382.1 C383.1 C384.1 C385.1 C386.1 C387.1 C394.2 C395.2 C396.2 C397.1 C398.1 C399.1 C400.1 C401.1 C402.1 C403.1 C404.1 C405.2 C406.1 C413.2 C414.1 C415.1 C416.1 C417.1 C418.2 C419.1 C420.1 C421.1 C422.1 C423.2 C424.1 C425.1 C426.1 C427.1 R100.1 R101.1 R102.1 R107.1 R108.1 R109.1 R110.1 R111.1 R112.1 R172.1 R173.1 U19.2(GND) U20.2(GND) U21.1(GND)  [project net 3.3V-5]
VDD7: BM19.34(VDD) BM20.34(VDD) BM21.34(VDD) C370.2 C371.1 C390.2 C391.1 C401.2 C402.2 C403.2 C404.2 C405.1 C409.2 C410.1 C414.2 C415.2 C416.2 C417.2 C418.1 C419.2 C420.2 C421.2 C422.2 C423.1 R172.2 R173.2  [project net 3.3V-6]
0.8V-7-1: BM19.18(VDDIO_08_1) C376.2 C377.2 C385.2 R99.2 U19.5(VOUT)
0.8V-7-2: BM21.14(PLL_VDD) BM21.15(VDDIO_O8_0) C380.2 C381.2 C424.2 R105.2 U20.5(VOUT)
1.8-7: BM19.17(VDDIO_18_1) C384.2 C396.1 U21.2(OUT) U21.4(TAB)
BO18: BM19.25(BI) ; off-sheet BO18
BO19: BM19.12(BO) BM20.25(BI) TP19.1(BO)
BO20: BM20.12(BO) BM21.25(BI) TP20.1(BO)
BO21: BM21.12(BO) TP21.1(BO) ; off-sheet BO21
CLK18: BM19.29(CLKI) ; off-sheet CLK18
CLK19: BM19.8(CLKO) BM20.29(CLKI) TP19.5(CLK)
CLK20: BM20.8(CLKO) BM21.29(CLKI) TP20.5(CLK)
CLK21: BM21.8(CLKO) TP21.5(CLK) ; off-sheet CLK21
CO18: BM19.28(CI) ; off-sheet CO18
CO19: BM19.9(CO) BM20.28(CI) TP19.4(CO)
CO20: BM20.9(CO) BM21.28(CI) TP20.4(CO)
CO21: BM21.9(CO) TP21.4(CO) ; off-sheet CO21
RI18: BM19.27(RO) ; off-sheet RI18
RI19: BM19.10(RI) BM20.27(RO) TP19.3(RI)
RI20: BM20.10(RI) BM21.27(RO) TP20.3(RI)
RI21: BM21.10(RI) TP21.3(RI) ; off-sheet RI21
RST18: BM19.26(NRSTI) ; off-sheet RST18
RST19: BM19.11(NRSTO) BM20.26(NRSTI) TP19.2(RST)
RST20: BM20.11(NRSTO) BM21.26(NRSTI) TP20.2(RST)
RST21: BM21.11(NRSTO) TP21.2(RST) ; off-sheet RST21
VDDIO-0.8-7-1: BM19.14(PLL_VDD) BM19.15(VDDIO_O8_0) BM20.18(VDDIO_08_1) C382.2 C400.2
VDDIO-0.8-7-2: BM20.14(PLL_VDD) BM20.15(VDDIO_O8_0) BM21.18(VDDIO_08_1) C397.2 C427.2
VDDIO-1.8-7-1: BM19.16(VDDIO_18_0) BM20.17(VDDIO_18_1) C383.2 C399.2
VDDIO-1.8-7-2: BM20.16(VDDIO_18_0) BM21.17(VDDIO_18_1) C398.2 C426.2
NetBM19_1: BM19.1(VDD3_0) C369.2 C370.1
NetBM19_2: BM19.2(VDD2_0) C368.2 C369.1
NetBM19_3: BM19.3(VDD1_0) C367.2 C368.1
NetBM19_4: BM19.4(ADDR0) R100.2
NetBM19_5: BM19.5(ADDR1) R101.2
NetBM19_6: BM19.6(ADDR2) R102.2
NetBM19_30: BM19.30(VDD1_1) C373.2 C374.1
NetBM19_31: BM19.31(VDD2_1) C372.2 C373.1
NetBM19_32: BM19.32(VDD3_1) C371.2 C372.1
NetBM20_1: BM20.1(VDD3_0) C389.2 C390.1
NetBM20_2: BM20.2(VDD2_0) C388.2 C389.1
NetBM20_3: BM20.3(VDD1_0) C387.2 C388.1
NetBM20_4: BM20.4(ADDR0) R107.2
NetBM20_5: BM20.5(ADDR1) R108.2
NetBM20_6: BM20.6(ADDR2) R109.2
NetBM20_30: BM20.30(VDD1_1) C393.2 C394.1
NetBM20_31: BM20.31(VDD2_1) C392.2 C393.1
NetBM20_32: BM20.32(VDD3_1) C391.2 C392.1
NetBM21_1: BM21.1(VDD3_0) C408.2 C409.1
NetBM21_2: BM21.2(VDD2_0) C407.2 C408.1
NetBM21_3: BM21.3(VDD1_0) C406.2 C407.1
NetBM21_4: BM21.4(ADDR0) R110.2
NetBM21_5: BM21.5(ADDR1) R111.2
NetBM21_6: BM21.6(ADDR2) R112.2
NetBM21_16: BM21.16(VDDIO_18_0) C425.2
NetBM21_30: BM21.30(VDD1_1) C412.2 C413.1
NetBM21_31: BM21.31(VDD2_1) C411.2 C412.1
NetBM21_32: BM21.32(VDD3_1) C410.2 C411.1
NetC375_2: C375.2 R97.2 R98.1 U19.1(VIN)
NetC378_2: C378.2 R99.1 U19.4(BP/FB)
NetC379_2: C379.2 R103.2 R104.1 U20.1(VIN)
NetC386_2: C386.2 R105.1 U20.4(BP/FB)
NetC395_1: C395.1 R106.2 U21.3(IN)
NetR98_2: R98.2 U19.3(EN)
NetR104_2: R104.2 U20.3(EN)

Not connected (* = marked no-connect by the designer): BM19 7(TEST)* 21(TEMP_N)* 22(TEMP_P)* 23(RF)* 24(TF)*; BM20 7(TEST)* 21(TEMP_N)* 22(TEMP_P)* 23(RF)* 24(TF)*; BM21 7(TEST)* 21(TEMP_N)* 22(TEMP_P)* 23(RF)* 24(TF)*

### Notes on the sheet
- 0.8 - OUT1
- BLOCK7
- 0.8 - OUT2
- (near C382) CHIP19
- 1.8 - OUT
- CAP-BANK
- TEST POINT
- CHIP20
- CHIP21

### Library data of the parts
BM19-BM21 = BM1397_0
C367-C394 C397-C404 C406-C417 C419-C422 C424-C427 = CAP
C395 C396 C405 C418 C423 = POLARIZED CAP
R97-R112 R172 R173 = RES